# Altium project v1-RP5-Main_Board.PrjPcb (part 2 of 3)

## Sheet Display.SchDoc
size B; SheetNumber: 3; SheetTotal: 7
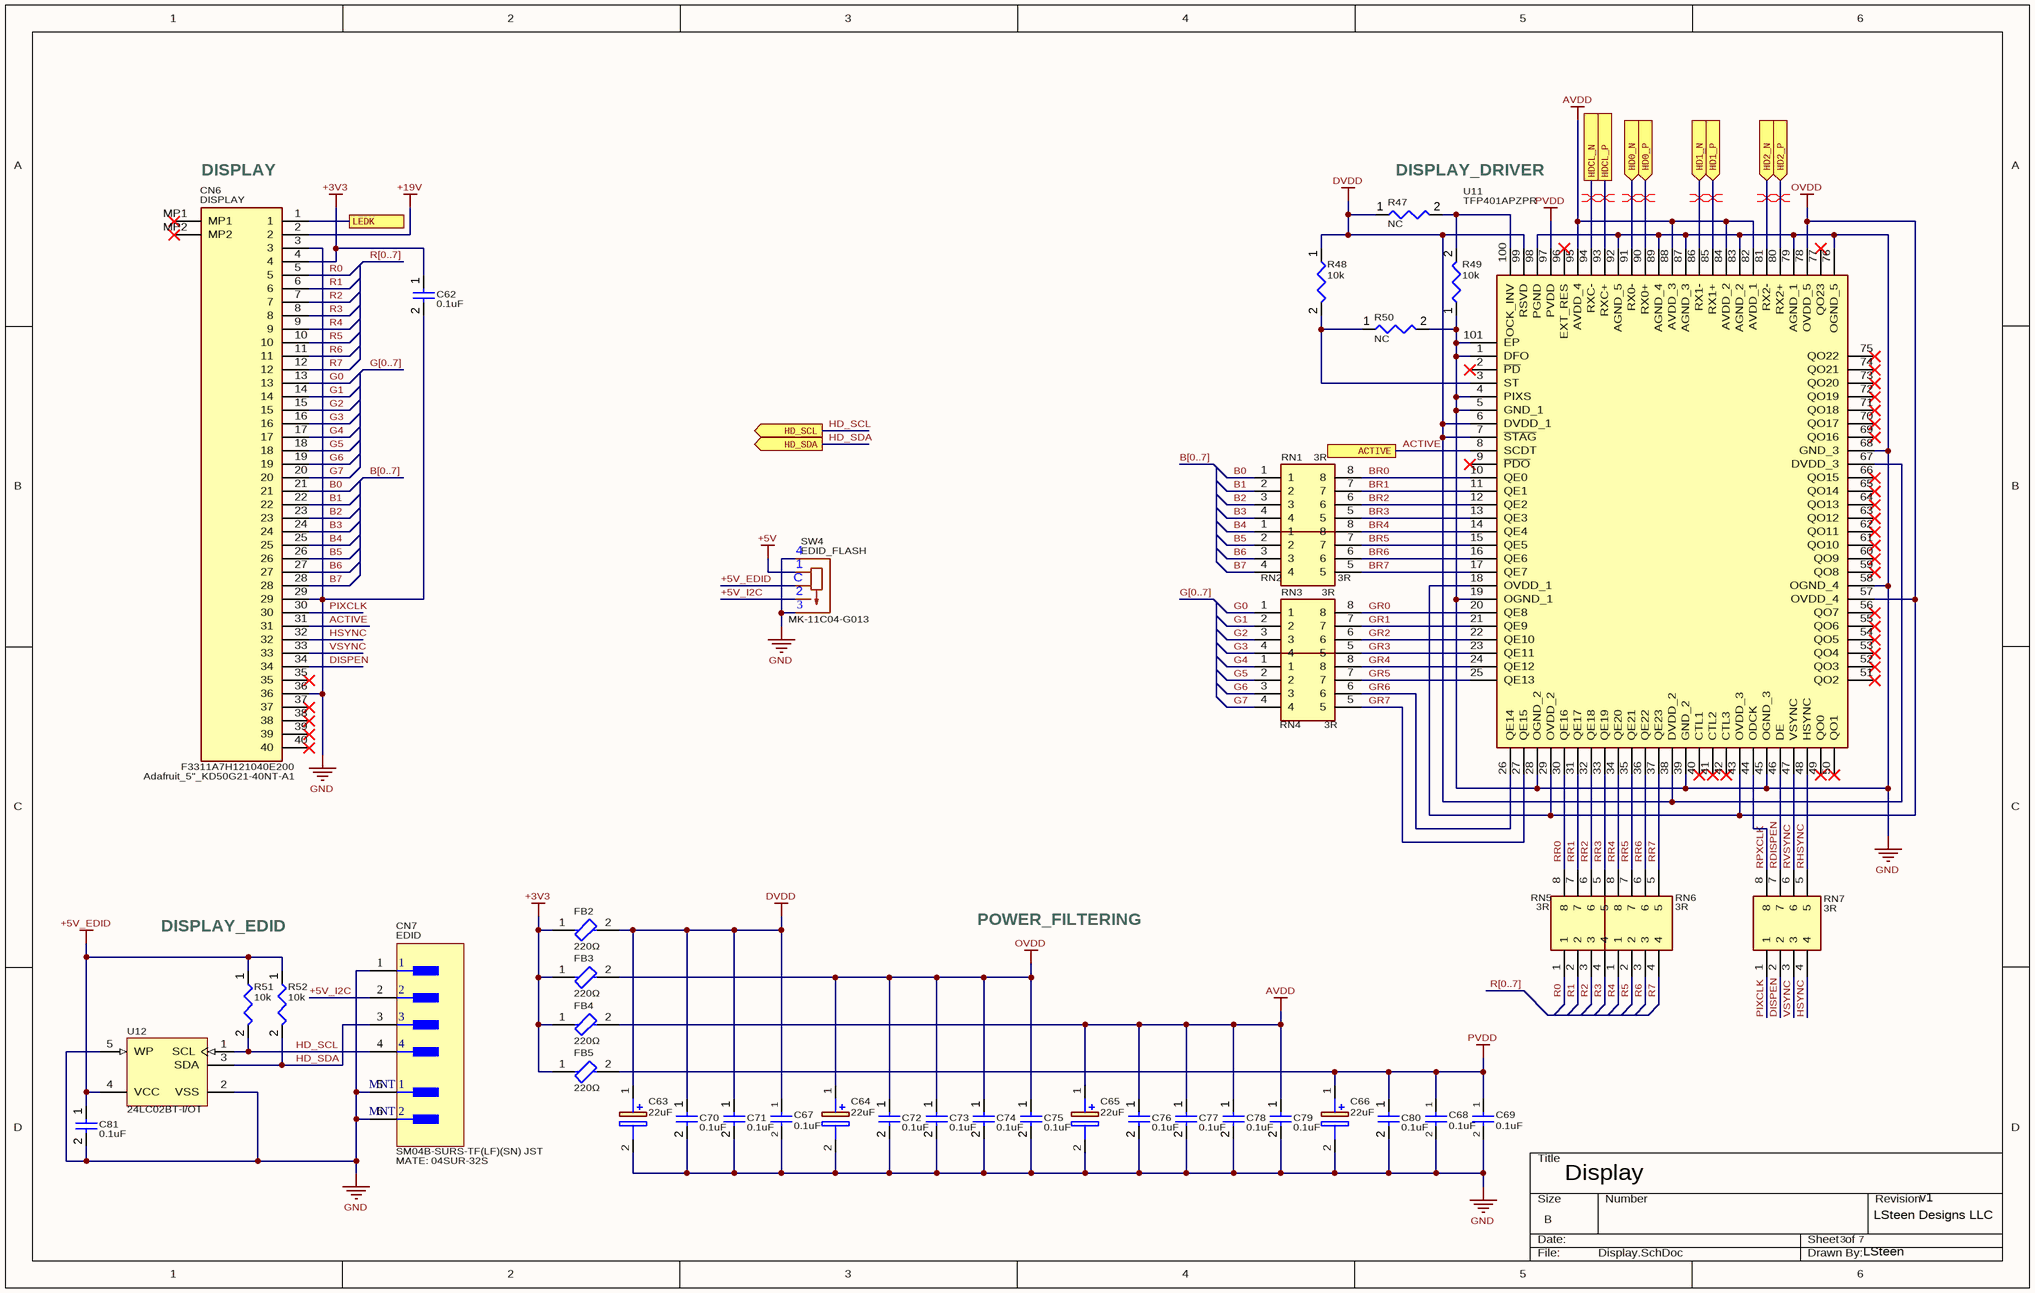
[diagram p2: Display.SchDoc]

### Parts
C62  0.1uF  [CAPC1005X56X25LL10T15]
C63  22uF  [CAPPC2114X150N]
C64  22uF  [CAPPC2114X150N]
C65  22uF  [CAPPC2114X150N]
C66  22uF  [CAPPC2114X150N]
C67  0.1uF  [CAPC1005X55N]
C68  0.1uF  [CAPC1005X55N]
C69  0.1uF  [CAPC1005X55N]
C70  0.1uF  [CAPC1005X56X25LL10T15]
C71  0.1uF  [CAPC1005X56X25LL10T15]
C72  0.1uF  [CAPC1005X56X25LL10T15]
C73  0.1uF  [CAPC1005X56X25LL10T15]
C74  0.1uF  [CAPC1005X56X25LL10T15]
C75  0.1uF  [CAPC1005X56X25LL10T15]
C76  0.1uF  [CAPC1005X56X25LL10T15]
C77  0.1uF  [CAPC1005X56X25LL10T15]
C78  0.1uF  [CAPC1005X56X25LL10T15]
C79  0.1uF  [CAPC1005X56X25LL10T15]
C80  0.1uF  [CAPC1005X56X25LL10T15]
C81  0.1uF  [CAPC1005X56X25LL10T15]
CN6  DISPLAY  [F3311A7H121040E200]
CN7  EDID  [FP-SM04B-SURS-TF_LF_SN-MFG]
FB2  220Ω  [FP-BLM18-0_15-t0_5-IPC_B]
FB3  220Ω  [FP-BLM18-0_15-t0_5-IPC_B]
FB4  220Ω  [FP-BLM18-0_15-t0_5-IPC_B]
FB5  220Ω  [FP-BLM18-0_15-t0_5-IPC_B]
R47  NC  [RESC0402(1005)_L]
R48  10k  [RESC0402(1005)_L]
R49  10k  [RESC0402(1005)_L]
R50  NC  [RESC0402(1005)_L]
R51  10k  [RESC0402(1005)_L]
R52  10k  [RESC0402(1005)_L]
RN1  3R  [YC124JR0733RL]
RN2  3R  [YC124JR0733RL]
RN3  3R  [YC124JR0733RL]
RN4  3R  [YC124JR0733RL]
RN5  3R  [YC124JR0733RL]
RN6  3R  [YC124JR0733RL]
RN7  3R  [YC124JR0733RL]
SW4  EDID_FLASH  [SW-SMD_MK-11C04-G013]
U11  TFP401APZPR  [QFP50P1600X1600X120-100N]
U12  24LC02BT-I/OT  [SOT-23-OT5_L]

### Ports
ACTIVE (see Power[5C]), HD0_N (in, see Module B High-Speed[4B]), HD0_P (in, see Module B High-Speed[4B]), HD1_N (in, see Module B High-Speed[4B]), HD1_P (in, see Module B High-Speed[4B]), HD2_N (in, see Module B High-Speed[4B]), HD2_P (in, see Module B High-Speed[4B]), HD_SCL (out, see Module B High-Speed[3B]), HD_SDA (out, see Module B High-Speed[3B]), HDCL_N (see Module B High-Speed[4B]), HDCL_P (see Module B High-Speed[4B]), LEDK (see Power[6B])

### Nets
+3V3: C62.1 CN6.4 FB2.1 FB3.1 FB4.1 FB5.1
+5V: SW4.1
+5V_EDID: C81.1 R51.1 R52.1 SW4.C U12.4(VCC)
+19V: CN6.2
AVDD: C65.1(+) C76.1 C77.1 C78.1 C79.1 FB4.2 U11.82(AVDD_1) U11.84(AVDD_2) U11.88(AVDD_3) U11.95(AVDD_4)
DVDD: C63.1(+) C67.1 C70.1 C71.1 FB2.2 R47.1 R48.1 U11.6(DVDD_1) U11.7(~{STAG}) U11.38(DVDD_2) U11.67(DVDD_3) U11.99(RSVD)
GND: C62.2 C63.2(-) C64.2(-) C65.2(-) C66.2(-) C67.2 C68.2 C69.2 C70.2 C71.2 C72.2 C73.2 C74.2 C75.2 C76.2 C77.2 C78.2 C79.2 C80.2 C81.2 CN6.3 CN6.29 CN6.36 CN7.1 CN7.5(MNT_1) CN7.6(MNT_2) R49.1 R50.2 SW4.3(NC) SW4.4 U11.1(DFO) U11.4(PIXS) U11.5(GND_1) U11.19(OGND_1) U11.28(OGND_2) U11.39(GND_2) U11.45(OGND_3) U11.58(OGND_4) U11.68(GND_3) U11.76(OGND_5) U11.79(AGND_1) U11.83(AGND_2) U11.87(AGND_3) U11.89(AGND_4) U11.92(AGND_5) U11.98(PGND) U11.101(EP) U12.2(VSS) U12.5(WP)
OVDD: C64.1(+) C72.1 C73.1 C74.1 C75.1 FB3.2 U11.18(OVDD_1) U11.29(OVDD_2) U11.43(OVDD_3) U11.57(OVDD_4) U11.78(OVDD_5)
PVDD: C66.1(+) C68.1 C69.1 C80.1 FB5.2 U11.97(PVDD)
+5V_I2C: CN7.2 SW4.2
ACTIVE: CN6.31 U11.8(SCDT) ; port ACTIVE
B0: CN6.21 RN1.1
B1: CN6.22 RN1.2
B2: CN6.23 RN1.3
B3: CN6.24 RN1.4
B4: CN6.25 RN2.1
B5: CN6.26 RN2.2
B6: CN6.27 RN2.3
B7: CN6.28 RN2.4
BR0: RN1.8 U11.10(QE0)
BR1: RN1.7 U11.11(QE1)
BR2: RN1.6 U11.12(QE2)
BR3: RN1.5 U11.13(QE3)
BR4: RN2.8 U11.14(QE4)
BR5: RN2.7 U11.15(QE5)
BR6: RN2.6 U11.16(QE6)
BR7: RN2.5 U11.17(QE7)
DISPEN: CN6.34 RN7.2
G0: CN6.13 RN3.1
G1: CN6.14 RN3.2
G2: CN6.15 RN3.3
G3: CN6.16 RN3.4
G4: CN6.17 RN4.1
G5: CN6.18 RN4.2
G6: CN6.19 RN4.3
G7: CN6.20 RN4.4
GR0: RN3.8 U11.20(QE8)
GR1: RN3.7 U11.21(QE9)
GR2: RN3.6 U11.22(QE10)
GR3: RN3.5 U11.23(QE11)
GR4: RN4.8 U11.24(QE12)
GR5: RN4.7 U11.25(QE13)
GR6: RN4.6 U11.26(QE14)
GR7: RN4.5 U11.27(QE15)
HD0_N: U11.91(RX0-) ; port HD0_N
HD0_P: U11.90(RX0+) ; port HD0_P
HD1_N: U11.86(RX1-) ; port HD1_N
HD1_P: U11.85(RX1+) ; port HD1_P
HD2_N: U11.81(RX2-) ; port HD2_N
HD2_P: U11.80(RX2+) ; port HD2_P
HD_SCL: CN7.4 R51.2 U12.1(SCL) ; port HD_SCL
HD_SDA: CN7.3 R52.2 U12.3(SDA) ; port HD_SDA
HDCL_N: U11.94(RXC-) ; port HDCL_N
HDCL_P: U11.93(RXC+) ; port HDCL_P
HSYNC: CN6.32 RN7.4
LEDK: CN6.1 ; port LEDK
PIXCLK: CN6.30 RN7.1
R0: CN6.5 RN5.1
R1: CN6.6 RN5.2
R2: CN6.7 RN5.3
R3: CN6.8 RN5.4
R4: CN6.9 RN6.1
R5: CN6.10 RN6.2
R6: CN6.11 RN6.3
R7: CN6.12 RN6.4
RDISPEN: RN7.7 U11.46(DE)
RHSYNC: RN7.5 U11.48(HSYNC)
RPXCLK: RN7.8 U11.44(ODCK)
RR0: RN5.8 U11.30(QE16)
RR1: RN5.7 U11.31(QE17)
RR2: RN5.6 U11.32(QE18)
RR3: RN5.5 U11.33(QE19)
RR4: RN6.8 U11.34(QE20)
RR5: RN6.7 U11.35(QE21)
RR6: RN6.6 U11.36(QE22)
RR7: RN6.5 U11.37(QE23)
RVSYNC: RN7.6 U11.47(VSYNC)
VSYNC: CN6.33 RN7.3
NetR47_2: R47.2 R49.2 U11.100(OCK_INV)
NetR48_2: R48.2 R50.1 U11.3(ST)

Not connected (* = marked no-connect by the designer): CN6 35* 37* 38* 39* 40* MP1* MP2*; U11 2(~{PD})* 9(~{PDO})* 40(CTL1)* 41(CTL2)* 42(CTL3)* 49(QO0)* 50(QO1)* 51(QO2)* 52(QO3)* 53(QO4)* 54(QO5)* 55(QO6)* 56(QO7)* 59(QO8)* 60(QO9)* 61(QO10)* 62(QO11)* 63(QO12)* 64(QO13)* 65(QO14)* 66(QO15)* 69(QO16)* 70(QO17)* 71(QO18)* 72(QO19)* 73(QO20)* 74(QO21)* 75(QO22)* 77(QO23)* 96(EXT_RES)*

### Buses and harness runs
bus B[0..7]
bus G[0..7]
bus R[0..7]

### Layout directives
differential pair; differential pair class HDMI: HD0_N, HD0_P, HD1_N, HD1_P, HD2_N, HD2_P, HDCL_N, HDCL_P

### Notes on the sheet
- (near CN6) DISPLAY
- (near R47) DISPLAY_DRIVER
- (near SW4) MK-11C04-G013
- (near CN6) F3311A7H121040E200
- (near CN6) Adafruit_5"_KD50G21-40NT-A1
- DISPLAY_EDID
- POWER_FILTERING
- (near CN7) MATE: 04SUR-32S
- (near CN7) SM04B-SURS-TF(LF)(SN) JST
- Display
- 3
- 7
- LSteen Designs LLC
- v1
- LSteen

### Library data of the parts
C62 C70-C81 = CMP-001-00001-6: as C14 on sheet Power; Max Operating Temperature: 125°C; Min Operating Temperature: -55°C; Case/Package: 0402; Value: 0.1uF; Mounting Technology: SM; Pins: 2; Tolerance: 5%; RoHS Compliant: True
C63-C66 = TACR226K006XTA: Capacitor Polarised; Manufacturer_Name: Kyocera AVX; Datasheet Link: https://datasheet.datasheetarchive.com/originals/dk/DKDS-7/134542.pdf; Height: 1.5mm; Manufacturer_Part_Number: TACR226K006XTA; Mouser Part Number: 581-TACR226K006X; Mouser Price/Stock: https://www.mouser.co.uk/ProductDetail/AVX/TACR226K006XTA?qs=1dejQ3qkUTm9Nv2ucYYT5g%3D%3D; Arrow Part Number: TACR226K006XTA; Arrow Price/Stock: https://www.arrow.com/en/products/tacr226k006xta/avx
C67-C69 = C0402: Height: 0.55mm
CN6 = F3311A7H121040E200: Connector; Manufacturer_Name: Amphenol Communications Solutions; Datasheet Link: https://cdn.amphenol-cs.com/media/wysiwyg/files/documentation/datasheet/flex/ffc_fpc_050mm_f331.pdf; Height: 1.22mm; Manufacturer_Part_Number: F3311A7H121040E200; Supplier 1: Mouser; Supplier Part Number 1: 649-311A7H121040E200
CN7 = CMP-17439-000307-2: CONN HEADER SMD R/A 4POS 0.8MM; NexarPartId: 2647826; Gender: Male; Working Voltage: 30V; Number of Poles: 4; Body Plating: Tin; Wire/Cable Gauge: 32AWG; Current Rating: 500mA; Termination: IDC; Material: Polyamide; Contact Plating: Tin; REACH SVHC: No SVHC; Max Operating Temperature: 85°C; Min Operating Temperature: -25°C; Flammability Rating: UL94 V-0; Number of Rows: 1; Contact Material: Tin; Number of Contacts: 4; Case/Package: SMD/SMT; Voltage Rating: 30V; Lead Pitch: 800µm; Lead Free: Lead Free; Height: 1.75mm; RoHS: Compliant; Voltage Rating (DC): 30V
FB2-FB5 = CMP-06046-002311-1: as FB1 on sheet Power; RoHS Compliant: Yes
R47 R50 = CMP-009-00138-3: Chip Resistor, 0 Ohms, +/-5 %, 63 mW, -55 to 155 degC, 0402; Value: 0R; Tolerance: 5%; Power: 63mW; Max Operating Temperature: 155°C; Pins: 2; Min Operating Temperature: -55°C; Case/Package: 0402
R48 R49 R51 R52 = CMP-009-00138-3: Chip Resistor, 10 kOhms, +/-5 %, 63 mW, -55 to 155 degC, 0402; Tolerance: 5%; Power: 63mW; Max Operating Temperature: 155°C; Pins: 2; Value: 10k; Min Operating Temperature: -55°C; Case/Package: 0402
RN1-RN7 = YC124-JR-073RL: Resistor Network; Manufacturer_Name: YAGEO; Manufacturer_Part_Number: YC124-JR-0733RL; Datasheet Link: https://www.yageo.com/upload/media/product/productsearch/datasheet/rchip/PYu-YC_TC_group_51_RoHS_L_9.pdf; Height: 0.55mm; Mouser Part Number: 603-YC124-JR-0733RL; Mouser Price/Stock: https://www.mouser.co.uk/ProductDetail/YAGEO/YC124-JR-0733RL?qs=o9qB%2F%252BVTi4U0zU6ismVxOQ%3D%3D; Arrow Part Number: YC124-JR-0733RL; Arrow Price/Stock: https://www.arrow.com/en/products/yc124-jr-0733rl/yageo?region=nac
SW4 = MK-11C04-G013: SPDT 1A 6V Slide Switch; Supplier 1: LCSC; Supplier Part Number 1: C778185
U11 = TFP401APZPR: Integrated Circuit; Manufacturer_Name: Texas Instruments; Datasheet Link: http://www.ti.com/lit/gpn/TFP401A; Height: 1.2mm; Manufacturer_Part_Number: TFP401APZPR; Mouser Part Number: 595-TFP401APZPR; Mouser Price/Stock: https://www.mouser.co.uk/ProductDetail/Texas-Instruments/TFP401APZPR?qs=lc2O%252BfHJPVYfuIDQbAsRYg%3D%3D; Arrow Part Number: TFP401APZPR; Arrow Price/Stock: https://www.arrow.com/en/products/tfp401apzpr/texas-instruments?region=nac; Supplier 1: Mouser; Supplier Part Number 1: 595-TFP401APZPR
U12 = CMP-0159-00645-1: 2Kbit, 400kHz, 2.5V, I2C Serial EEPROM, 5-Pin SOT-23, Industrial Temperature, Tape and Reel; PackageVersion: revBB, Aug-2009; DatasheetVersion: revJ, Feb-2009; PackageDescription: 5-Lead Plastic Small Outline Transistor (OT) [SOT-23]; PackageReference: SOT-23-OT5; Code_IPC: SOT23-5

## Sheet Module A IO.SchDoc
size A2; SheetNumber: 4; SheetTotal: 7
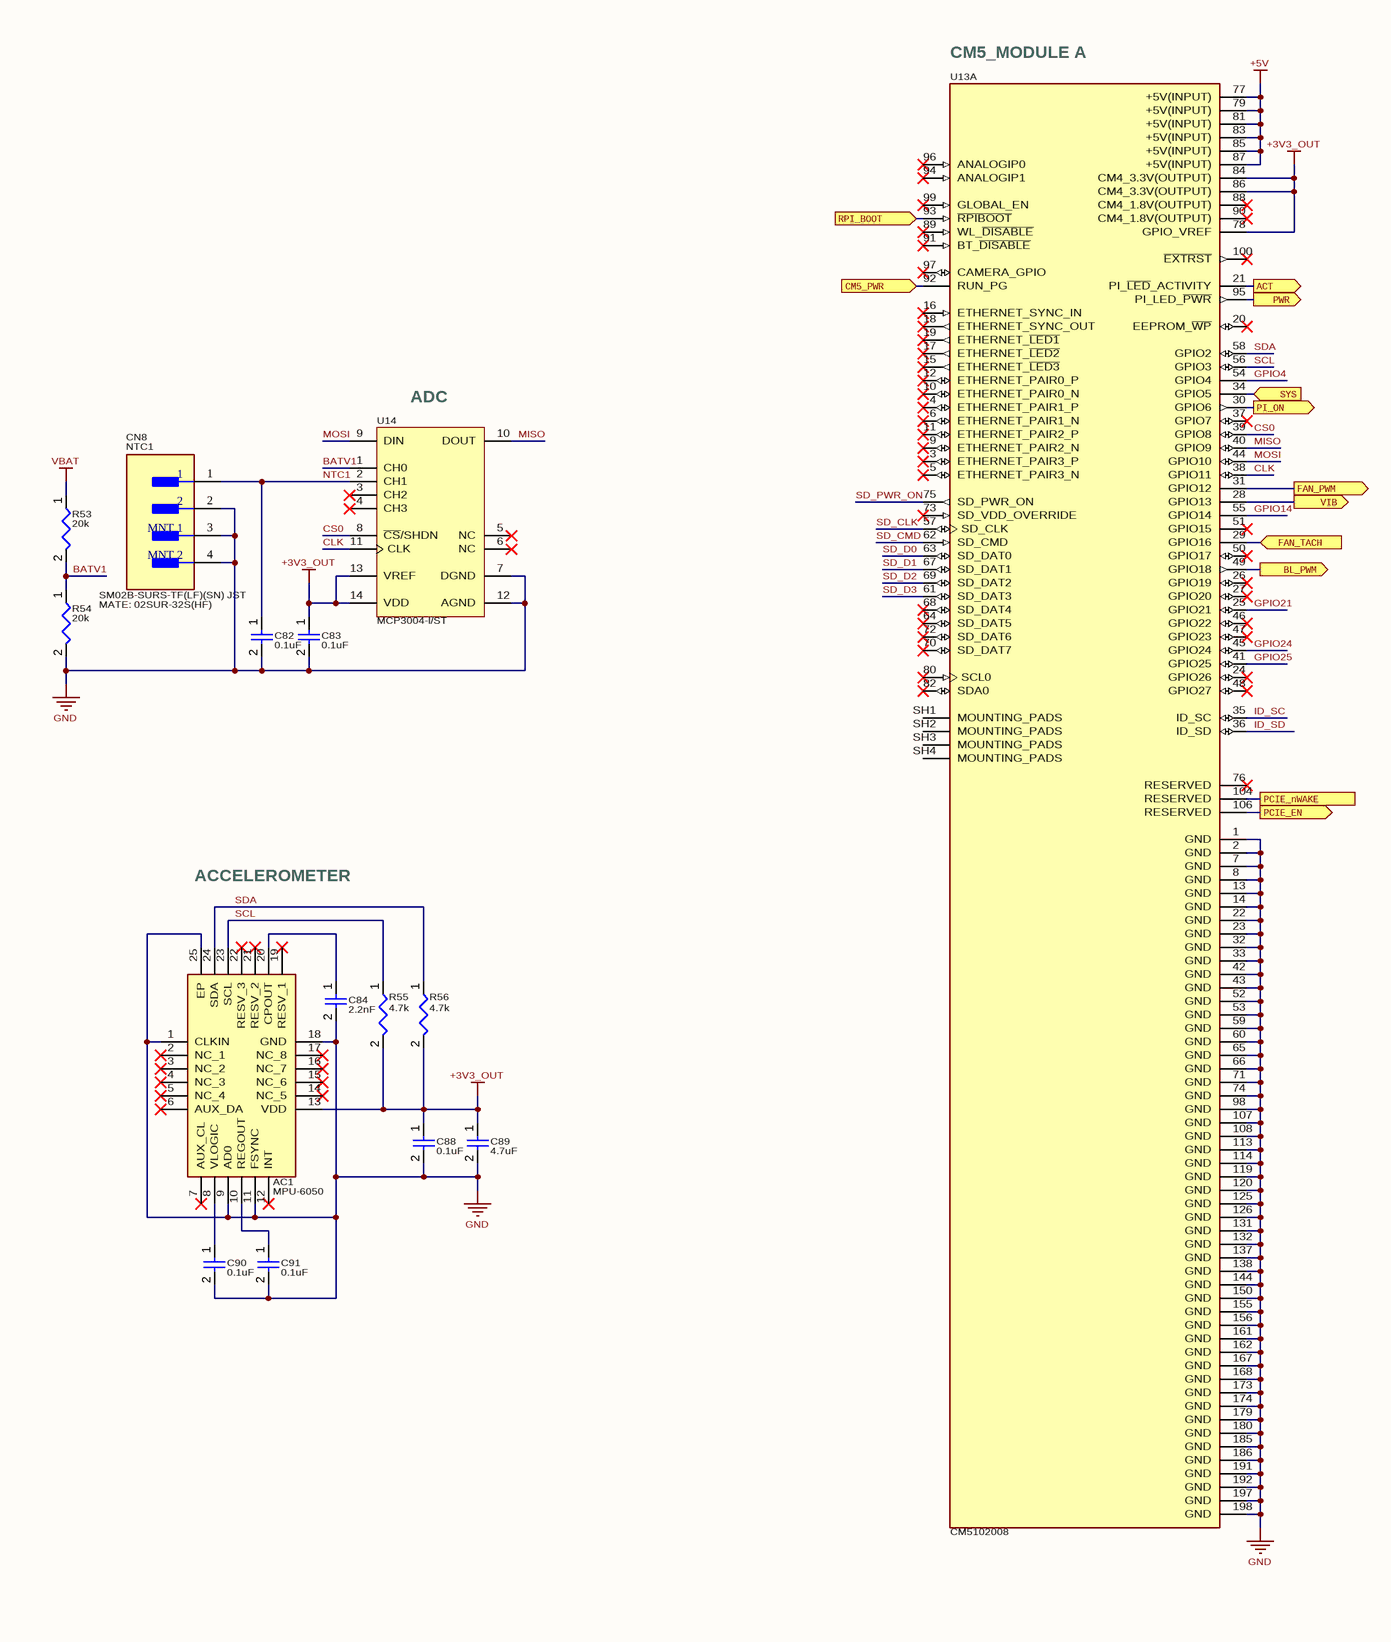
[diagram p3: Module A IO.SchDoc, left]
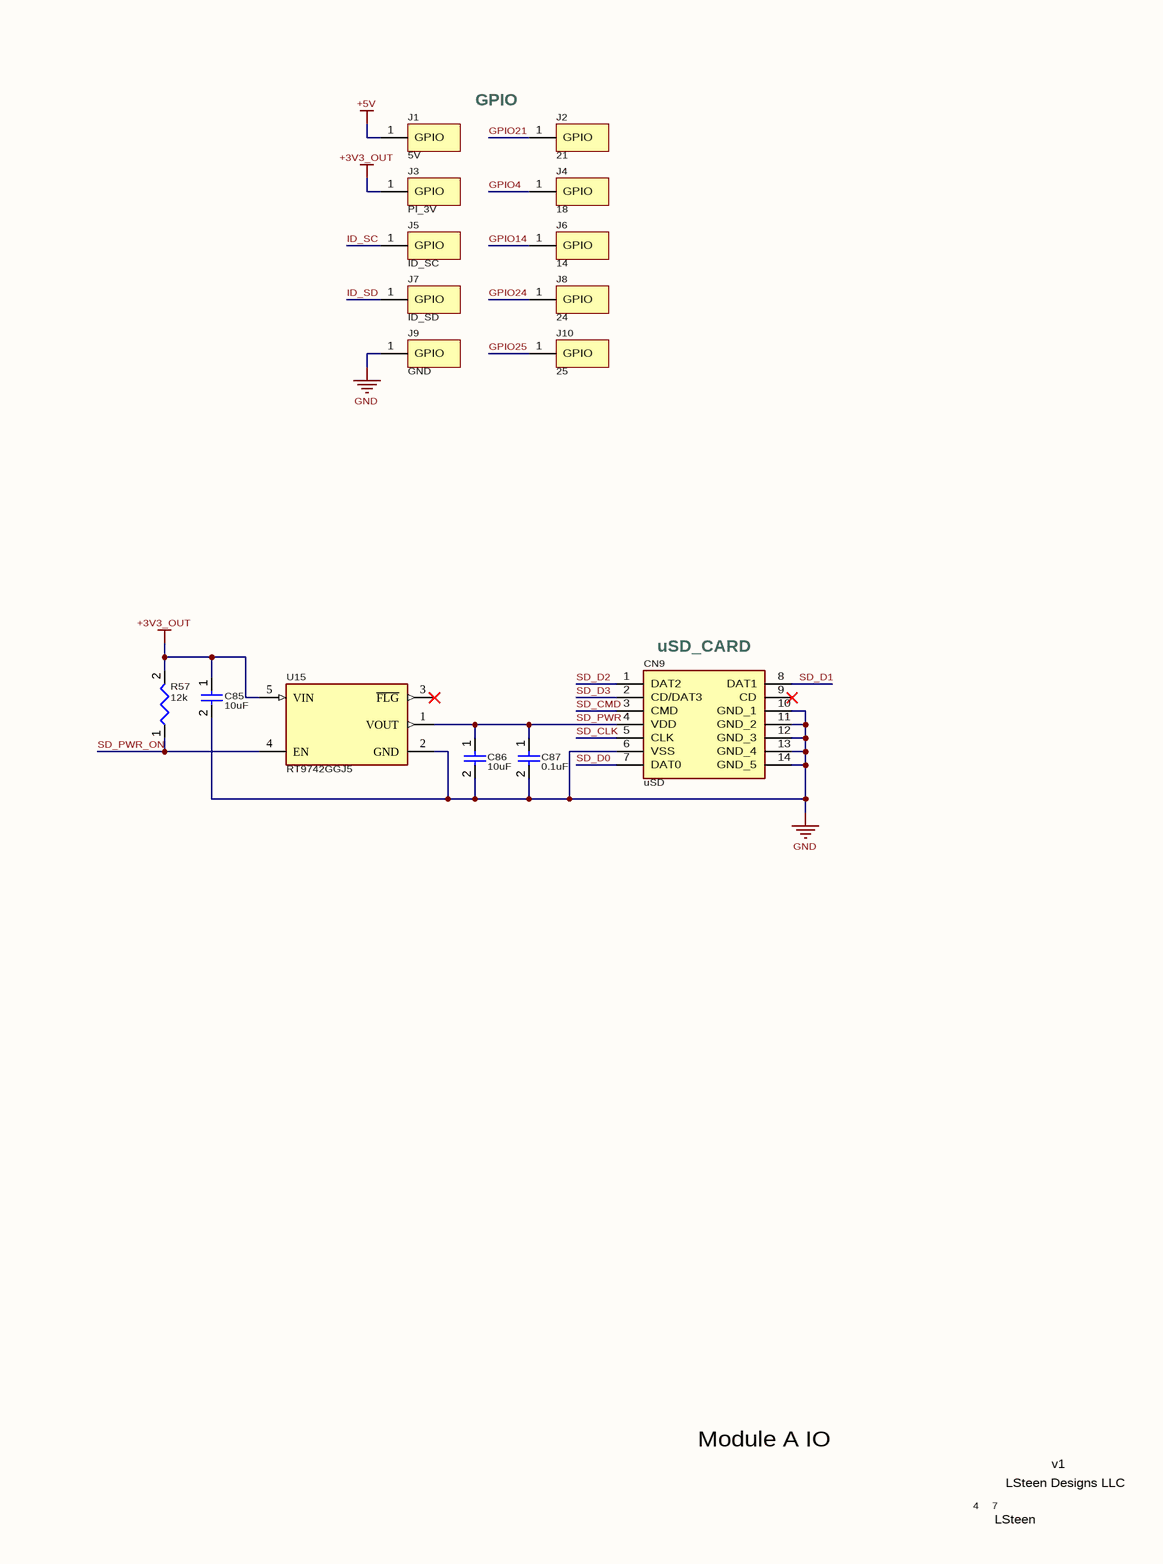
[diagram p4: Module A IO.SchDoc, right]

### Parts
AC1  MPU-6050  [MPU6050]
C82  0.1uF  [CAPC1005X56X25LL10T15]
C83  0.1uF  [CAPC1005X56X25LL10T15]
C84  2.2nF  [CAPC1005X56X25LL10T15]
C85  10uF  [CAPC0603(1608)100_L]
C86  10uF  [CAPC0603(1608)100_L]
C87  0.1uF  [CAPC1005X56X25LL10T15]
C88  0.1uF  [CAPC1005X56X25LL10T15]
C89  4.7uF  [CAPC0603(1608)100_L]
C90  0.1uF  [CAPC1005X56X25LL10T15]
C91  0.1uF  [CAPC1005X56X25LL10T15]
CN8  NTC1  [FP-SM02B-SURS-TF_LF_SN-MFG]
CN9  uSD  [MSD9A]
J1  5V  [GPIO]
J2  21  [GPIO]
J3  PI_3V  [GPIO]
J4  18  [GPIO]
J5  ID_SC  [GPIO]
J6  14  [GPIO]
J7  ID_SD  [GPIO]
J8  24  [GPIO]
J9  GND  [GPIO]
J10  25  [GPIO]
R53  20k  [RESC0402(1005)_L]
R54  20k  [RESC0402(1005)_L]
R55  4.7k  [RESC0402(1005)_L]
R56  4.7k  [RESC0402(1005)_L]
R57  12k  [RESC0402(1005)_L]
U13  CM5102008  [MODULE_CM4102008]  (part A of 2)
U14  MCP3004-I/ST  [TSSOP-ST14_M]
U15  RT9742GGJ5  [FP-RT9742GGJ5-IPC_C]

### Ports
ACT (out, see USB[5B]), BL_PWM (out, see Power[5B]), CM5_PWR (in, see Power[5D]), FAN_PWM (out, see Power[4C]), FAN_TACH (in, see Power[4C]), PCIE_EN (out, see USB[6B]), PCIE_nWAKE (see USB[7B]), PI_ON (out, see Power[6D]), PWR (out, see USB[5B]), RPI_BOOT (in, see USB[6D]), SYS (in, see USB[5B]), VIB (out, see USB[7B])

### Nets
+3V3_OUT: AC1.13(VDD) C83.1 C85.1 C88.1 C89.1 J3.1(GPIO) R55.2 R56.2 R57.2 U13.78(GPIO_VREF) U13.84(CM4_3.3V(OUTPUT)) U13.86(CM4_3.3V(OUTPUT)) U14.13(VREF) U14.14(VDD) U15.5(VIN)
+5V: J1.1(GPIO) U13.77(+5V(INPUT)) U13.79(+5V(INPUT)) U13.81(+5V(INPUT)) U13.83(+5V(INPUT)) U13.85(+5V(INPUT)) U13.87(+5V(INPUT))
GND: AC1.1(CLKIN) AC1.9(AD0) AC1.11(FSYNC) AC1.18(GND) AC1.25(EP) C82.2 C83.2 C84.2 C85.2 C86.2 C87.2 C88.2 C89.2 C90.2 C91.2 CN8.2 CN8.3(MNT_1) CN8.4(MNT_2) CN9.6(VSS) CN9.10(GND_1) CN9.11(GND_2) CN9.12(GND_3) CN9.13(GND_4) CN9.14(GND_5) J9.1(GPIO) R54.2 U13.1(GND) U13.2(GND) U13.7(GND) U13.8(GND) U13.13(GND) U13.14(GND) U13.22(GND) U13.23(GND) U13.32(GND) U13.33(GND) U13.42(GND) U13.43(GND) U13.52(GND) U13.53(GND) U13.59(GND) U13.60(GND) U13.65(GND) U13.66(GND) U13.71(GND) U13.74(GND) U13.98(GND) U13.107(GND) U13.108(GND) U13.113(GND) U13.114(GND) U13.119(GND) U13.120(GND) U13.125(GND) U13.126(GND) U13.131(GND) U13.132(GND) U13.137(GND) U13.138(GND) U13.144(GND) U13.150(GND) U13.155(GND) U13.156(GND) U13.161(GND) U13.162(GND) U13.167(GND) U13.168(GND) U13.173(GND) U13.174(GND) U13.179(GND) U13.180(GND) U13.185(GND) U13.186(GND) U13.191(GND) U13.192(GND) U13.197(GND) U13.198(GND) U14.7(DGND) U14.12(AGND) U15.2(GND)
VBAT: R53.1
ACT: U13.21(PI_~{LED}_ACTIVITY) ; port ACT
BATV1: R53.2 R54.1 U14.1(CH0)
BL_PWM: U13.49(GPIO18) ; port BL_PWM
CLK: U13.38(GPIO11) U14.11(CLK)
CM5_PWR: U13.92(RUN_PG) ; port CM5_PWR
CS0: U13.39(GPIO8) U14.8(~{CS}/SHDN)
FAN_PWM: U13.31(GPIO12) ; port FAN_PWM
FAN_TACH: U13.29(GPIO16) ; port FAN_TACH
GPIO4: J4.1(GPIO) U13.54(GPIO4)
GPIO14: J6.1(GPIO) U13.55(GPIO14)
GPIO21: J2.1(GPIO) U13.25(GPIO21)
GPIO24: J8.1(GPIO) U13.45(GPIO24)
GPIO25: J10.1(GPIO) U13.41(GPIO25)
ID_SC: J5.1(GPIO) U13.35(ID_SC)
ID_SD: J7.1(GPIO) U13.36(ID_SD)
MISO: U13.40(GPIO9) U14.10(DOUT)
MOSI: U13.44(GPIO10) U14.9(DIN)
NTC1: C82.1 CN8.1 U14.2(CH1)
PCIE_EN: U13.106(RESERVED) ; port PCIE_EN
PCIE_nWAKE: U13.104(RESERVED) ; port PCIE_nWAKE
PI_ON: U13.30(GPIO6) ; port PI_ON
PWR: U13.95(PI_LED_~{PWR}) ; port PWR
RPI_BOOT: U13.93(~{RPIBOOT}) ; port RPI_BOOT
SCL: AC1.23(SCL) R55.1 U13.56(GPIO3)
SD_CLK: CN9.5(CLK) U13.57(SD_CLK)
SD_CMD: CN9.3(CMD) U13.62(SD_CMD)
SD_D0: CN9.7(DAT0) U13.63(SD_DAT0)
SD_D1: CN9.8(DAT1) U13.67(SD_DAT1)
SD_D2: CN9.1(DAT2) U13.69(SD_DAT2)
SD_D3: CN9.2(CD/DAT3) U13.61(SD_DAT3)
SD_PWR: C86.1 C87.1 CN9.4(VDD) U15.1(VOUT)
SD_PWR_ON: R57.1 U13.75(SD_PWR_ON) U15.4(EN)
SDA: AC1.24(SDA) R56.1 U13.58(GPIO2)
SYS: U13.34(GPIO5) ; port SYS
VIB: U13.28(GPIO13) ; port VIB
NetAC1_8: AC1.8(VLOGIC) C90.1
NetAC1_10: AC1.10(REGOUT) C91.1
NetAC1_20: AC1.20(CPOUT) C84.1

Not connected (* = marked no-connect by the designer): AC1 2(NC_1)* 3(NC_2)* 4(NC_3)* 5(NC_4)* 6(AUX_DA)* 7(AUX_CL)* 12(INT)* 14(NC_5)* 15(NC_6)* 16(NC_7)* 17(NC_8)* 19(RESV_1)* 21(RESV_2)* 22(RESV_3)*; CN9 9(CD)*; U13 3(ETHERNET_PAIR3_P)* 4(ETHERNET_PAIR1_P)* 5(ETHERNET_PAIR3_N)* 6(ETHERNET_PAIR1_N)* 9(ETHERNET_PAIR2_N)* 10(ETHERNET_PAIR0_N)* 11(ETHERNET_PAIR2_P)* 12(ETHERNET_PAIR0_P)* 15(ETHERNET_~{LED3})* 16(ETHERNET_SYNC_IN)* 17(ETHERNET_~{LED2})* 18(ETHERNET_SYNC_OUT)* 19(ETHERNET_~{LED1})* 20(EEPROM_~{WP})* 24(GPIO26)* 26(GPIO19)* 27(GPIO20)* 37(GPIO7)* 46(GPIO22)* 47(GPIO23)* 48(GPIO27)* 50(GPIO17)* 51(GPIO15)* 64(SD_DAT5)* 68(SD_DAT4)* 70(SD_DAT7)* 72(SD_DAT6)* 73(SD_VDD_OVERRIDE)* 76(RESERVED)* 80(SCL0)* 82(SDA0)* 88(CM4_1.8V(OUTPUT))* 89(WL_~{DISABLE})* 90(CM4_1.8V(OUTPUT))* 91(BT_~{DISABLE})* 94(ANALOGIP1)* 96(ANALOGIP0)* 97(CAMERA_GPIO)* 99(GLOBAL_EN)* 100(~{EXTRST})* SH1(MOUNTING_PADS) SH2(MOUNTING_PADS) SH3(MOUNTING_PADS) SH4(MOUNTING_PADS); U14 3(CH2)* 4(CH3)* 5(NC)* 6(NC)*; U15 3(~{FLG})*

### Notes on the sheet
- (near U13) CM5_MODULE A
- (near U14) ADC
- GPIO
- MATE: 02SUR-32S(HF)
- SM02B-SURS-TF(LF)(SN) JST
- ACCELEROMETER
- (near CN9) uSD_CARD
- Module A IO
- 4
- 7
- LSteen
- LSteen Designs LLC
- v1

### Library data of the parts
AC1 = MPU-6050: Integrated Circuit; Manufacturer_Name: TDK; Datasheet Link: https://product.tdk.com/system/files/dam/doc/product/sensor/mortion-inertial/imu/data_sheet/mpu-6000-datasheet1.pdf; Height: 0.95mm; Manufacturer_Part_Number: MPU-6050; Mouser Part Number: 410-MPU-6050; Mouser Price/Stock: https://www.mouser.co.uk/ProductDetail/TDK-InvenSense/MPU-6050?qs=u4fy%2FsgLU9O14B5JgyQFvg%3D%3D; Arrow Part Number: MPU-6050; Arrow Price/Stock: https://www.arrow.com/en/products/mpu-6050/invensense?region=nac; Supplier 1: LCSC; Supplier Part Number 1: C24112
C82 C83 C87 C88 C90 C91 = CMP-001-00001-6: as C14 on sheet Power; Max Operating Temperature: 125°C; Min Operating Temperature: -55°C; Case/Package: 0402; Value: 0.1uF; Mounting Technology: SM; Pins: 2; Tolerance: 5%; RoHS Compliant: True
C84 = CMP-001-00001-6: Chip Capacitor, 2.2nF, +/- 5%, 16 V, 0402 (1005 Metric); Capacitor Type: Ceramic; Voltage Rating: 16V; Max Operating Temperature: 125°C; Min Operating Temperature: -55°C; Case/Package: 0402; Value: 2.2nF; Mounting Technology: SM; Pins: 2; Tolerance: 5%; RoHS Compliant: True
C85 C86 = CMP-001-00076-4: as C13 on sheet Power; Mounting Technology: SMT; Case/Package: 0603; Pins: 2; Min Operating Temperature: -55°C; Max Operating Temperature: 85°C; Value: 10uF; Voltage Rating: 10V
C89 = CMP-001-00076-4: Chip Capacitor, 4.7uF +/-20%, 10V, 0603, Thickness 1 mm; Tolerance: 10%; Mounting Technology: SMT; Case/Package: 0603; Pins: 2; Min Operating Temperature: -55°C; Max Operating Temperature: 85°C; Value: 4.7uF; Voltage Rating: 10V
CN8 = CMP-17439-000279-1: as CN3 on sheet Power; Lead Pitch: 0.8mm; Color: Natural; Min Operating Temperature: -25°C; Insulation Material: Nylon; Number of Rows: 1; Flammability Rating: UL94 V-0; Number of Positions: 2; Contact Shape: Rectangular; Orientation: Horizontal; Contact Material: Copper Alloy; Fastening Type: Pull; Max Operating Temperature: 85°C; Termination: Solder; Contact Type: Outer Shroud Contact; Series: SUR; Insulation Color: Natural; Packaging: Cut Tape; Contact Finish - Mating: TIN; REACH SVHC: No SVHC; Pitch: 0.8mm; Contact Plating: Tin; Lead Free: Lead Free; Voltage Rating: 30V; Mount: Surface Mount; Connector Type: Header; Number of Poles: 2; Material: Polyamide
CN9 = MSD-9-A: Connector; Manufacturer_Name: CUI Devices; Datasheet Link: https://www.cuidevices.com/product/resource/msd-9-a.pdf; Height: 1.65mm; Manufacturer_Part_Number: MSD-9-A; Supplier 1: Mouser; Supplier Part Number 1: 179-MSD-9-A
J1-J10 = GPIO: AUX_I/O
R53 R54 = CMP-009-00138-3: Chip Resistor, 20 kOhms, +/-5 %, 63 mW, -55 to 155 degC, 0402; Value: 40k; Tolerance: 5%; Power: 63mW; Max Operating Temperature: 155°C; Pins: 2; Min Operating Temperature: -55°C; Case/Package: 0402
R55 R56 = CMP-009-00138-3: Chip Resistor, 4.7 kOhms, +/-5 %, 63 mW, -55 to 155 degC, 0402; Tolerance: 5%; Power: 63mW; Max Operating Temperature: 155°C; Pins: 2; Value: 4.7k; Min Operating Temperature: -55°C; Case/Package: 0402
R57 = CMP-009-00138-3: Chip Resistor, 12 kOhms, +/-5 %, 63 mW, -55 to 155 degC, 0402; Tolerance: 5%; Power: 63mW; Max Operating Temperature: 155°C; Pins: 2; Value: 12k; Min Operating Temperature: -55°C; Case/Package: 0402
U13 = CM4102008: Raspberry Pi Compute Module 4 with WiFi 2GB RAM 8GB Flash | Raspberry Pi CM4102008; SnapEDA_Link: https://www.snapeda.com/parts/CM4102008/Raspberry+Pi/view-part/?ref=snap; Package: None; Value: *; MF: Raspberry Pi; MP: CM4102008; Check_prices: https://www.snapeda.com/parts/CM4102008/Raspberry+Pi/view-part/?ref=eda
U14 = CMP-0188-00879-2: 2.7V 4-Channel/8-Channel 10-Bit A/D Converters with SPI Serial Interface, 14-Pin TSSOP, Industrial Temperature; ComponentLink1URL: http://www.microchip.com/; RevisionNote: URLs added.; PackageDescription: 14-Lead Plastic Thin Shrink Small Outline (ST) - 4.4mm Body [TSSOP]; ComponentLink3Description: Package Specification; ComponentLink2Description: Datasheet; ComponentLink3URL: http://www.microchip.com/stellent/groups/techpub_sg/documents/packagingspec/en012702.pdf; PackageReference: TSSOP-ST14; PackageVersion: revBB, Aug-2009; ComponentLink1Description: Manufacturer URL; ComponentLink2URL: http://ww1.microchip.com/downloads/en/DeviceDoc/21295d.pdf; DatasheetVersion: revD, Dec-2008
U15 = CMP-79883-000001-1: IC PWR SWTCH N-CHAN 1:1 TSOT23-5; Interface: On/Off; Fault Protection: Over Temperature; Max Output Current: 1A; Number of Outputs: 1; Output Configuration: High Side; On-State Resistance: 70mR; REACH SVHC: No SVHC; Number of Pins: 23; Packaging: Tape and Reel; Case/Package: SOT-23-5; RoHS Compliant: Yes; Max Operating Temperature: 85°C; Min Operating Temperature: -40°C

## Sheet Module B High-Speed.SchDoc
size A3; SheetNumber: 5; SheetTotal: 7
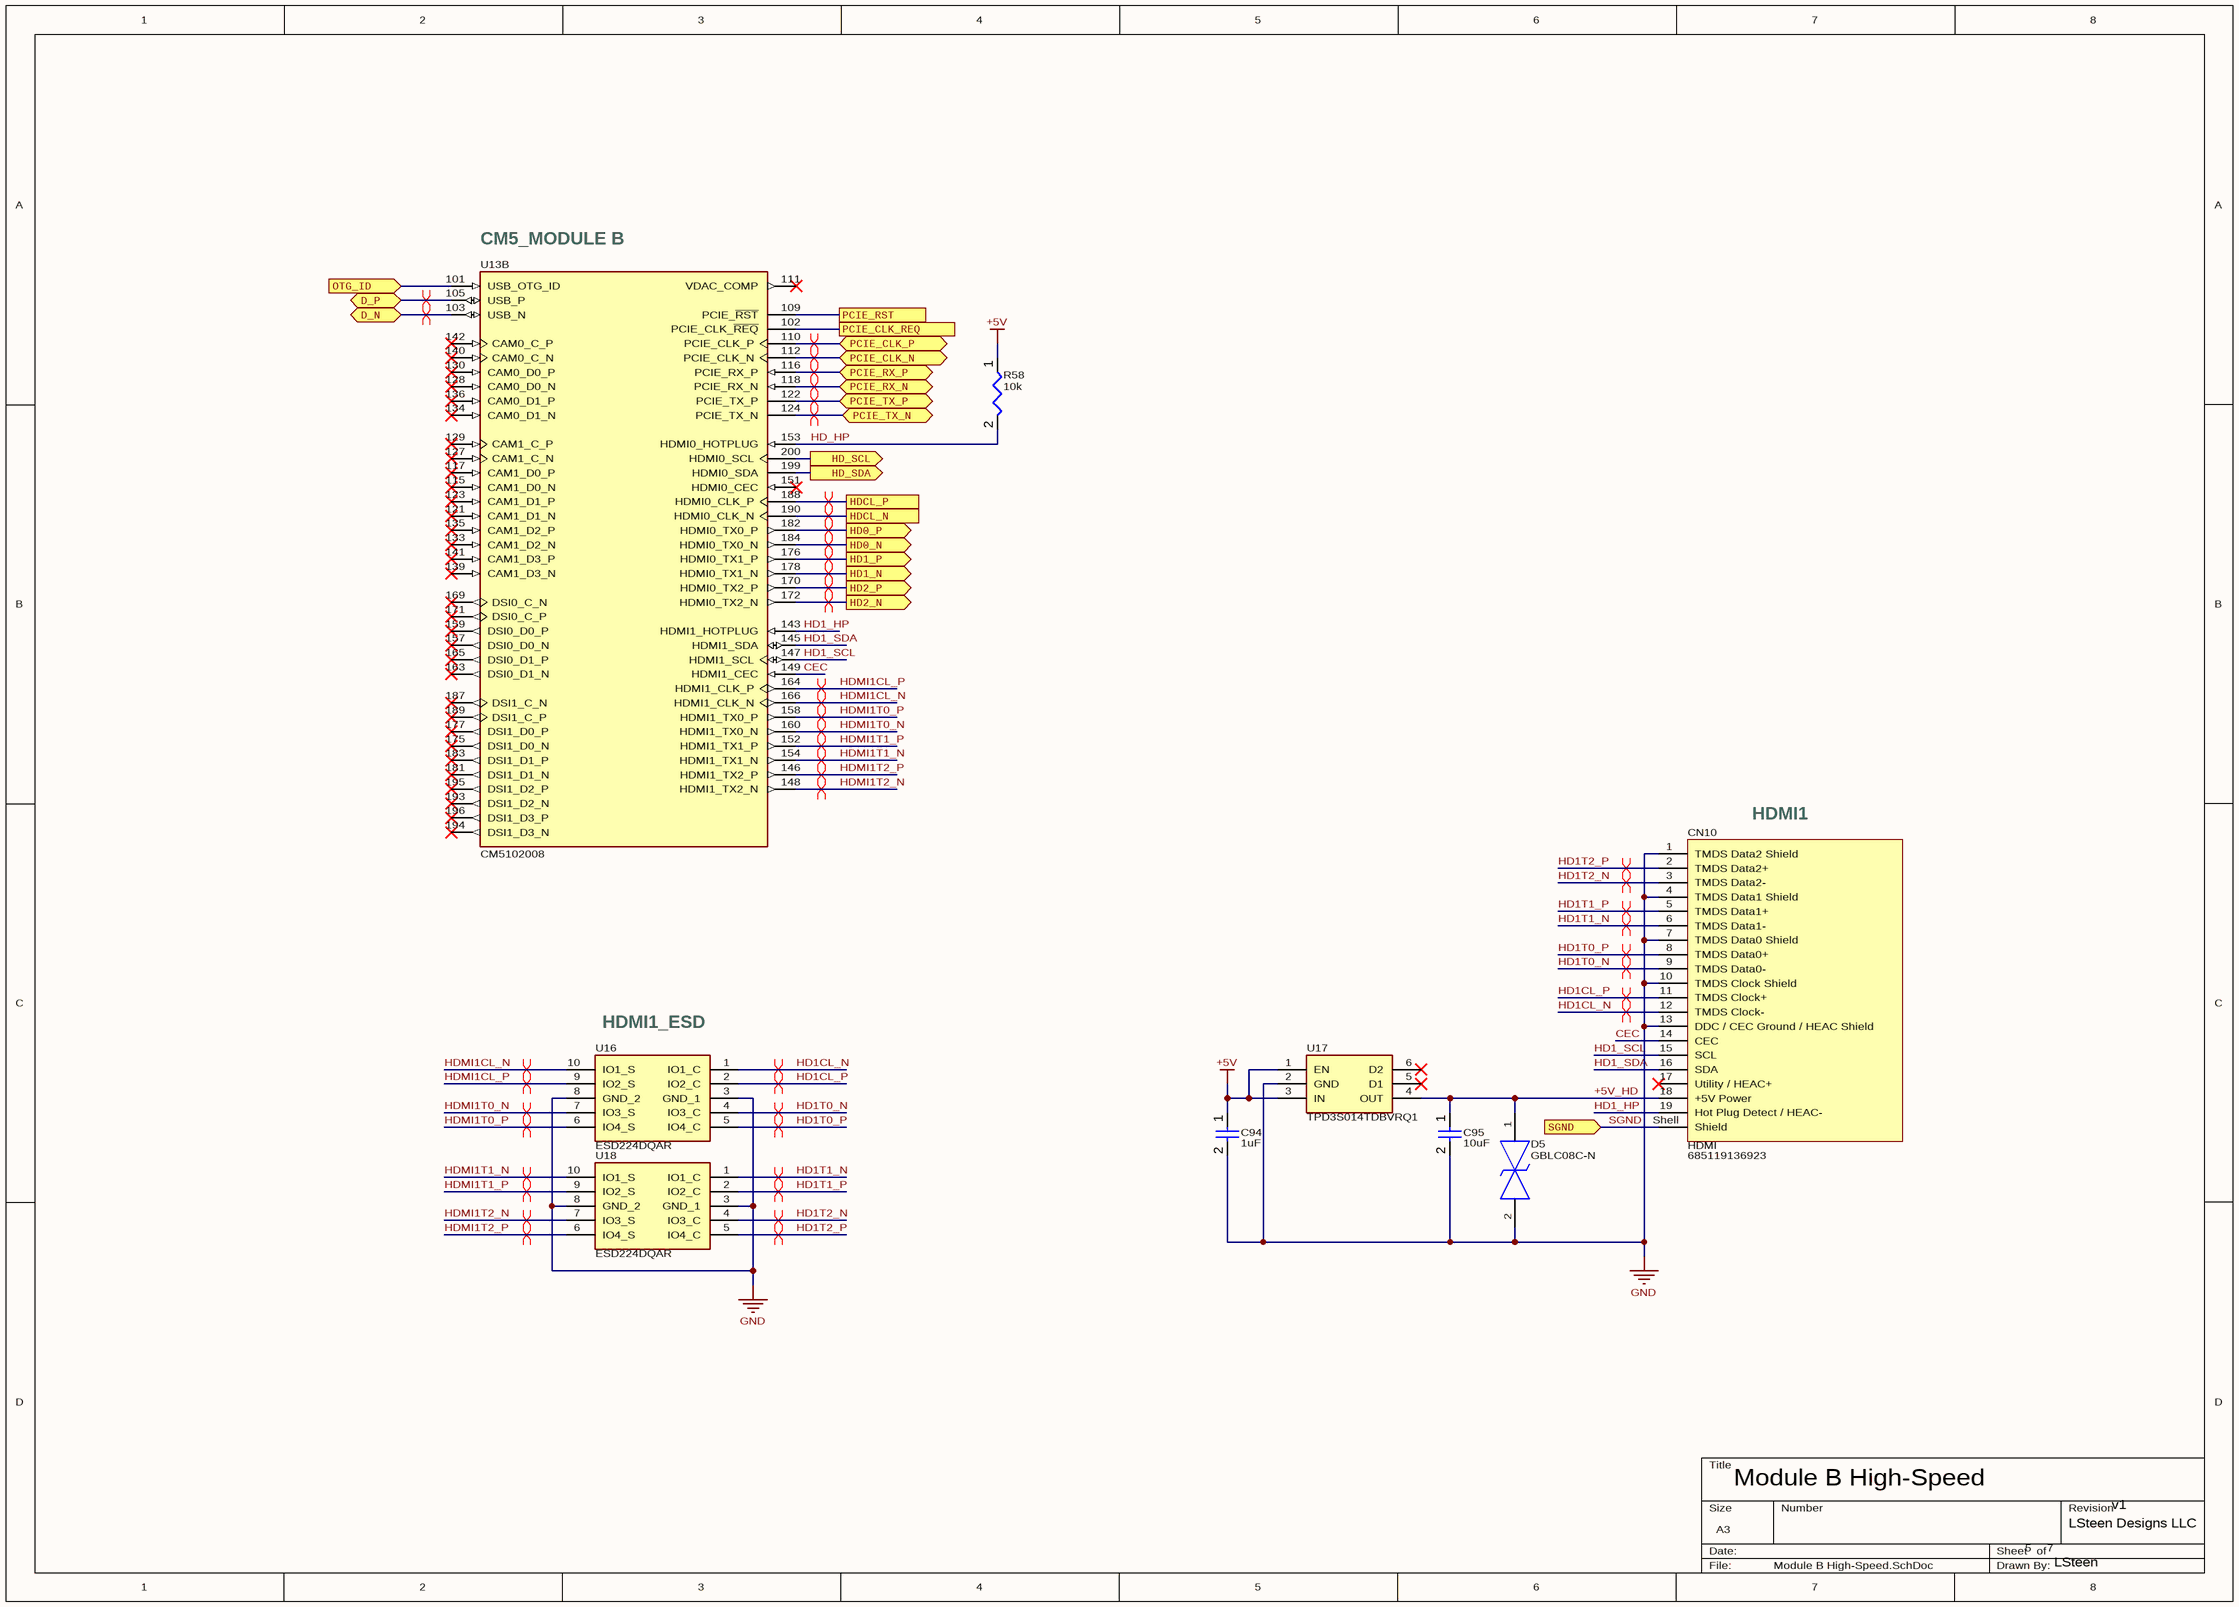
[diagram p5: Module B High-Speed.SchDoc]

### Parts
C94  1uF  [CAPC0603(1608)100_L]
C95  10uF  [CAPC0805(2012)145_L]
CN10  HDMI  [685119136923]
D5  GBLC08C-N  [SOD-323_L1.8-W1.3-LS2.5-BI]
R58  10k  [RESC0402(1005)_L]
U13  CM5102008  [MODULE_CM4102008]  (part B of 2)
U16  ESD224DQAR  [ESD224DQAR]
U17  TPD3S014TDBVRQ1  [SOT95P280X145-6N]
U18  ESD224DQAR  [ESD224DQAR]

### Ports
D_N (bidir, see USB[3C]), D_P (bidir, see USB[3C]), HD0_N (out, see Display[5A]), HD0_P (out, see Display[5A]), HD1_N (out, see Display[6A]), HD1_P (out, see Display[6A]), HD2_N (out, see Display[6A]), HD2_P (out, see Display[6A]), HD_SCL (out, see Display[3B]), HD_SDA (out, see Display[3B]), HDCL_N (see Display[5A]), HDCL_P (see Display[5A]), OTG_ID (in, see USB[2C]), PCIE_CLK_N (bidir, see USB[7B]), PCIE_CLK_P (bidir, see USB[7B]), PCIE_CLK_REQ (see USB[7B]), PCIE_RST (see USB[7B]), PCIE_RX_N (bidir, see USB[7B]), PCIE_RX_P (bidir, see USB[7B]), PCIE_TX_N (bidir, see USB[7B]), PCIE_TX_P (bidir, see USB[7B]), SGND (in, see Power[1A])

### Nets
+5V: C94.1 R58.1 U17.1(EN) U17.3(IN)
GND: C94.2 C95.2 CN10.1(TMDS_Data2_Shield) CN10.4(TMDS_Data1_Shield) CN10.7(TMDS_Data0_Shield) CN10.10(TMDS_Clock_Shield) CN10.13(DDC_/_CEC_Ground_/_HEAC_Shield) D5.2 U16.3(GND_1) U16.8(GND_2) U17.2(GND) U18.3(GND_1) U18.8(GND_2)
+5V_HD: C95.1 CN10.18(+5V_Power) D5.1 U17.4(OUT)
CEC: CN10.14(CEC) U13.149(HDMI1_CEC)
D_N: U13.103(USB_N) ; port D_N
D_P: U13.105(USB_P) ; port D_P
HD0_N: U13.184(HDMI0_TX0_N) ; port HD0_N
HD0_P: U13.182(HDMI0_TX0_P) ; port HD0_P
HD1_HP: CN10.19(Hot_Plug_Detect_/_HEAC-) U13.143(HDMI1_HOTPLUG)
HD1_N: U13.178(HDMI0_TX1_N) ; port HD1_N
HD1_P: U13.176(HDMI0_TX1_P) ; port HD1_P
HD1_SCL: CN10.15(SCL) U13.147(HDMI1_SCL)
HD1_SDA: CN10.16(SDA) U13.145(HDMI1_SDA)
HD1CL_N: CN10.12(TMDS_Clock-) U16.1(IO1_C)
HD1CL_P: CN10.11(TMDS_Clock+) U16.2(IO2_C)
HD1T0_N: CN10.9(TMDS_Data0-) U16.4(IO3_C)
HD1T0_P: CN10.8(TMDS_Data0+) U16.5(IO4_C)
HD1T1_N: CN10.6(TMDS_Data1-) U18.1(IO1_C)
HD1T1_P: CN10.5(TMDS_Data1+) U18.2(IO2_C)
HD1T2_N: CN10.3(TMDS_Data2-) U18.4(IO3_C)
HD1T2_P: CN10.2(TMDS_Data2+) U18.5(IO4_C)
HD2_N: U13.172(HDMI0_TX2_N) ; port HD2_N
HD2_P: U13.170(HDMI0_TX2_P) ; port HD2_P
HD_HP: R58.2 U13.153(HDMI0_HOTPLUG)
HD_SCL: U13.200(HDMI0_SCL) ; port HD_SCL
HD_SDA: U13.199(HDMI0_SDA) ; port HD_SDA
HDCL_N: U13.190(HDMI0_CLK_N) ; port HDCL_N
HDCL_P: U13.188(HDMI0_CLK_P) ; port HDCL_P
HDMI1CL_N: U13.166(HDMI1_CLK_N) U16.10(IO1_S)
HDMI1CL_P: U13.164(HDMI1_CLK_P) U16.9(IO2_S)
HDMI1T0_N: U13.160(HDMI1_TX0_N) U16.7(IO3_S)
HDMI1T0_P: U13.158(HDMI1_TX0_P) U16.6(IO4_S)
HDMI1T1_N: U13.154(HDMI1_TX1_N) U18.10(IO1_S)
HDMI1T1_P: U13.152(HDMI1_TX1_P) U18.9(IO2_S)
HDMI1T2_N: U13.148(HDMI1_TX2_N) U18.7(IO3_S)
HDMI1T2_P: U13.146(HDMI1_TX2_P) U18.6(IO4_S)
OTG_ID: U13.101(USB_OTG_ID) ; port OTG_ID
PCIE_CLK_N: U13.112(PCIE_CLK_N) ; port PCIE_CLK_N
PCIE_CLK_P: U13.110(PCIE_CLK_P) ; port PCIE_CLK_P
PCIE_CLK_REQ: U13.102(PCIE_CLK_~{REQ}) ; port PCIE_CLK_REQ
PCIE_RST: U13.109(PCIE_~{RST}) ; port PCIE_RST
PCIE_RX_N: U13.118(PCIE_RX_N) ; port PCIE_RX_N
PCIE_RX_P: U13.116(PCIE_RX_P) ; port PCIE_RX_P
PCIE_TX_N: U13.124(PCIE_TX_N) ; port PCIE_TX_N
PCIE_TX_P: U13.122(PCIE_TX_P) ; port PCIE_TX_P
SGND: CN10.Shell(Shield) ; port SGND

Not connected (* = marked no-connect by the designer): CN10 17(Utility_/_HEAC+)*; U13 111(VDAC_COMP)* 115(CAM1_D0_N)* 117(CAM1_D0_P)* 121(CAM1_D1_N)* 123(CAM1_D1_P)* 127(CAM1_C_N)* 128(CAM0_D0_N)* 129(CAM1_C_P)* 130(CAM0_D0_P)* 133(CAM1_D2_N)* 134(CAM0_D1_N)* 135(CAM1_D2_P)* 136(CAM0_D1_P)* 139(CAM1_D3_N)* 140(CAM0_C_N)* 141(CAM1_D3_P)* 142(CAM0_C_P)* 151(HDMI0_CEC)* 157(DSI0_D0_N)* 159(DSI0_D0_P)* 163(DSI0_D1_N)* 165(DSI0_D1_P)* 169(DSI0_C_N)* 171(DSI0_C_P)* 175(DSI1_D0_N)* 177(DSI1_D0_P)* 181(DSI1_D1_N)* 183(DSI1_D1_P)* 187(DSI1_C_N)* 189(DSI1_C_P)* 193(DSI1_D2_N)* 194(DSI1_D3_N)* 195(DSI1_D2_P)* 196(DSI1_D3_P)*; U17 5(D1)* 6(D2)*

### Layout directives
differential pair; differential pair class HDMI: HD0_N, HD0_P, HD1_N, HD1_P, HD1CL_N, HD1CL_P, HD1T0_N, HD1T0_P, HD1T1_N, HD1T1_P, HD1T2_N, HD1T2_P, HD2_N, HD2_P, HDCL_N, HDCL_P, HDMI1CL_N, HDMI1CL_P, HDMI1T0_N, HDMI1T0_P, HDMI1T1_N, HDMI1T1_P, HDMI1T2_N, HDMI1T2_P
differential pair; differential pair class USB 2.0: D_N, D_P
differential pair; differential pair class PCIe Gen 3x1: PCIE_CLK_N, PCIE_CLK_P, PCIE_RX_N, PCIE_RX_P, PCIE_TX_N, PCIE_TX_P

### Notes on the sheet
- (near U13) CM5_MODULE B
- HDMI1
- (near U16) HDMI1_ESD
- (near CN10) 685119136923
- Module B High-Speed
- 5
- 7
- LSteen Designs LLC
- v1
- LSteen

### Library data of the parts
C94 = CMP-001-00076-4: as C54 on sheet Power; Mounting Technology: SMT; Case/Package: 0603; Pins: 2; Min Operating Temperature: -55°C; Max Operating Temperature: 85°C; Value: 1uF; Voltage Rating: 10V
C95 = CMP-001-00079-4: as C3 on sheet Power; Max Operating Temperature: 85°C; Value: 10µF; Case/Package: 0805; Voltage Rating: 25V; Min Operating Temperature: -55°C; Mounting Technology: SMT; Pins: 2
CN10 = CMP-1502-00171-2: NexarPartId: 19499823; Number of Contacts: 19; Gender: Receptacle; Operating Supply Voltage: 40V; Contact Resistance: 30mΩ; Body Material: Brass; Current Rating: 500mA; Insulation Resistance: 100MΩ; Lead Free: Lead Free; Max Operating Temperature: 85°C; Packaging: Tape and Reel; Min Operating Temperature: -25°C; Features: Shielded; Orientation: Horizontal; Height: 3.45mm; Number of Positions: 19; Voltage Rating: 40V; Number of Pins: 19; Connector Type: HDMI; Mount: Horizontal, Surface Mount; Contact Material: Gold; Termination: SMD/SMT; Contact Plating: Gold; RoHS: Compliant; REACH SVHC: Unknown
D5 = GBLC08C-N: ESD DIODE-BI_LCSC#C314256
R58 = CMP-009-00138-3: as R48 on sheet Display; Max Operating Temperature: 155°C; Pins: 2; Value: 10k; Min Operating Temperature: -55°C; Case/Package: 0402
U13 = CM4102008: as U13 on sheet Module A IO; SnapEDA_Link: https://www.snapeda.com/parts/CM4102008/Raspberry+Pi/view-part/?ref=snap; Package: None; Value: *; MF: Raspberry Pi; MP: CM4102008; Check_prices: https://www.snapeda.com/parts/CM4102008/Raspberry+Pi/view-part/?ref=eda
U16 U18 = ESD224DQAR: Integrated Circuit; Manufacturer_Name: Texas Instruments; Datasheet Link: http://www.ti.com/lit/gpn/esd224; Height: 0.55mm; Manufacturer_Part_Number: ESD224DQAR; Mouser Part Number: 595-ESD224DQAR; Mouser Price/Stock: https://www.mouser.co.uk/ProductDetail/Texas-Instruments/ESD224DQAR?qs=F5EMLAvA7IDFPTOz5JtaBw%3D%3D; Arrow Part Number: ESD224DQAR; Arrow Price/Stock: https://www.arrow.com/en/products/esd224dqar/texas-instruments?region=nac
U17 = TPD3S014TDBVRQ1: Switch; Manufacturer_Name: Texas Instruments; Datasheet Link: http://www.ti.com/lit/gpn/tpd3s014-q1; Height: 1.45mm; Manufacturer_Part_Number: TPD3S014TDBVRQ1; Mouser Part Number: 595-TPD3S014TDBVRQ1; Mouser Price/Stock: https://www.mouser.co.uk/ProductDetail/Texas-Instruments/TPD3S014TDBVRQ1?qs=f4l5qYp%2Fy%252B4t4RRhQp5Ndw%3D%3D; Arrow Part Number: TPD3S014TDBVRQ1; Arrow Price/Stock: https://www.arrow.com/en/products/tpd3s014tdbvrq1/texas-instruments?region=nac

## Sheet Audio.SchDoc
size A3; SheetNumber: 6; SheetTotal: 7
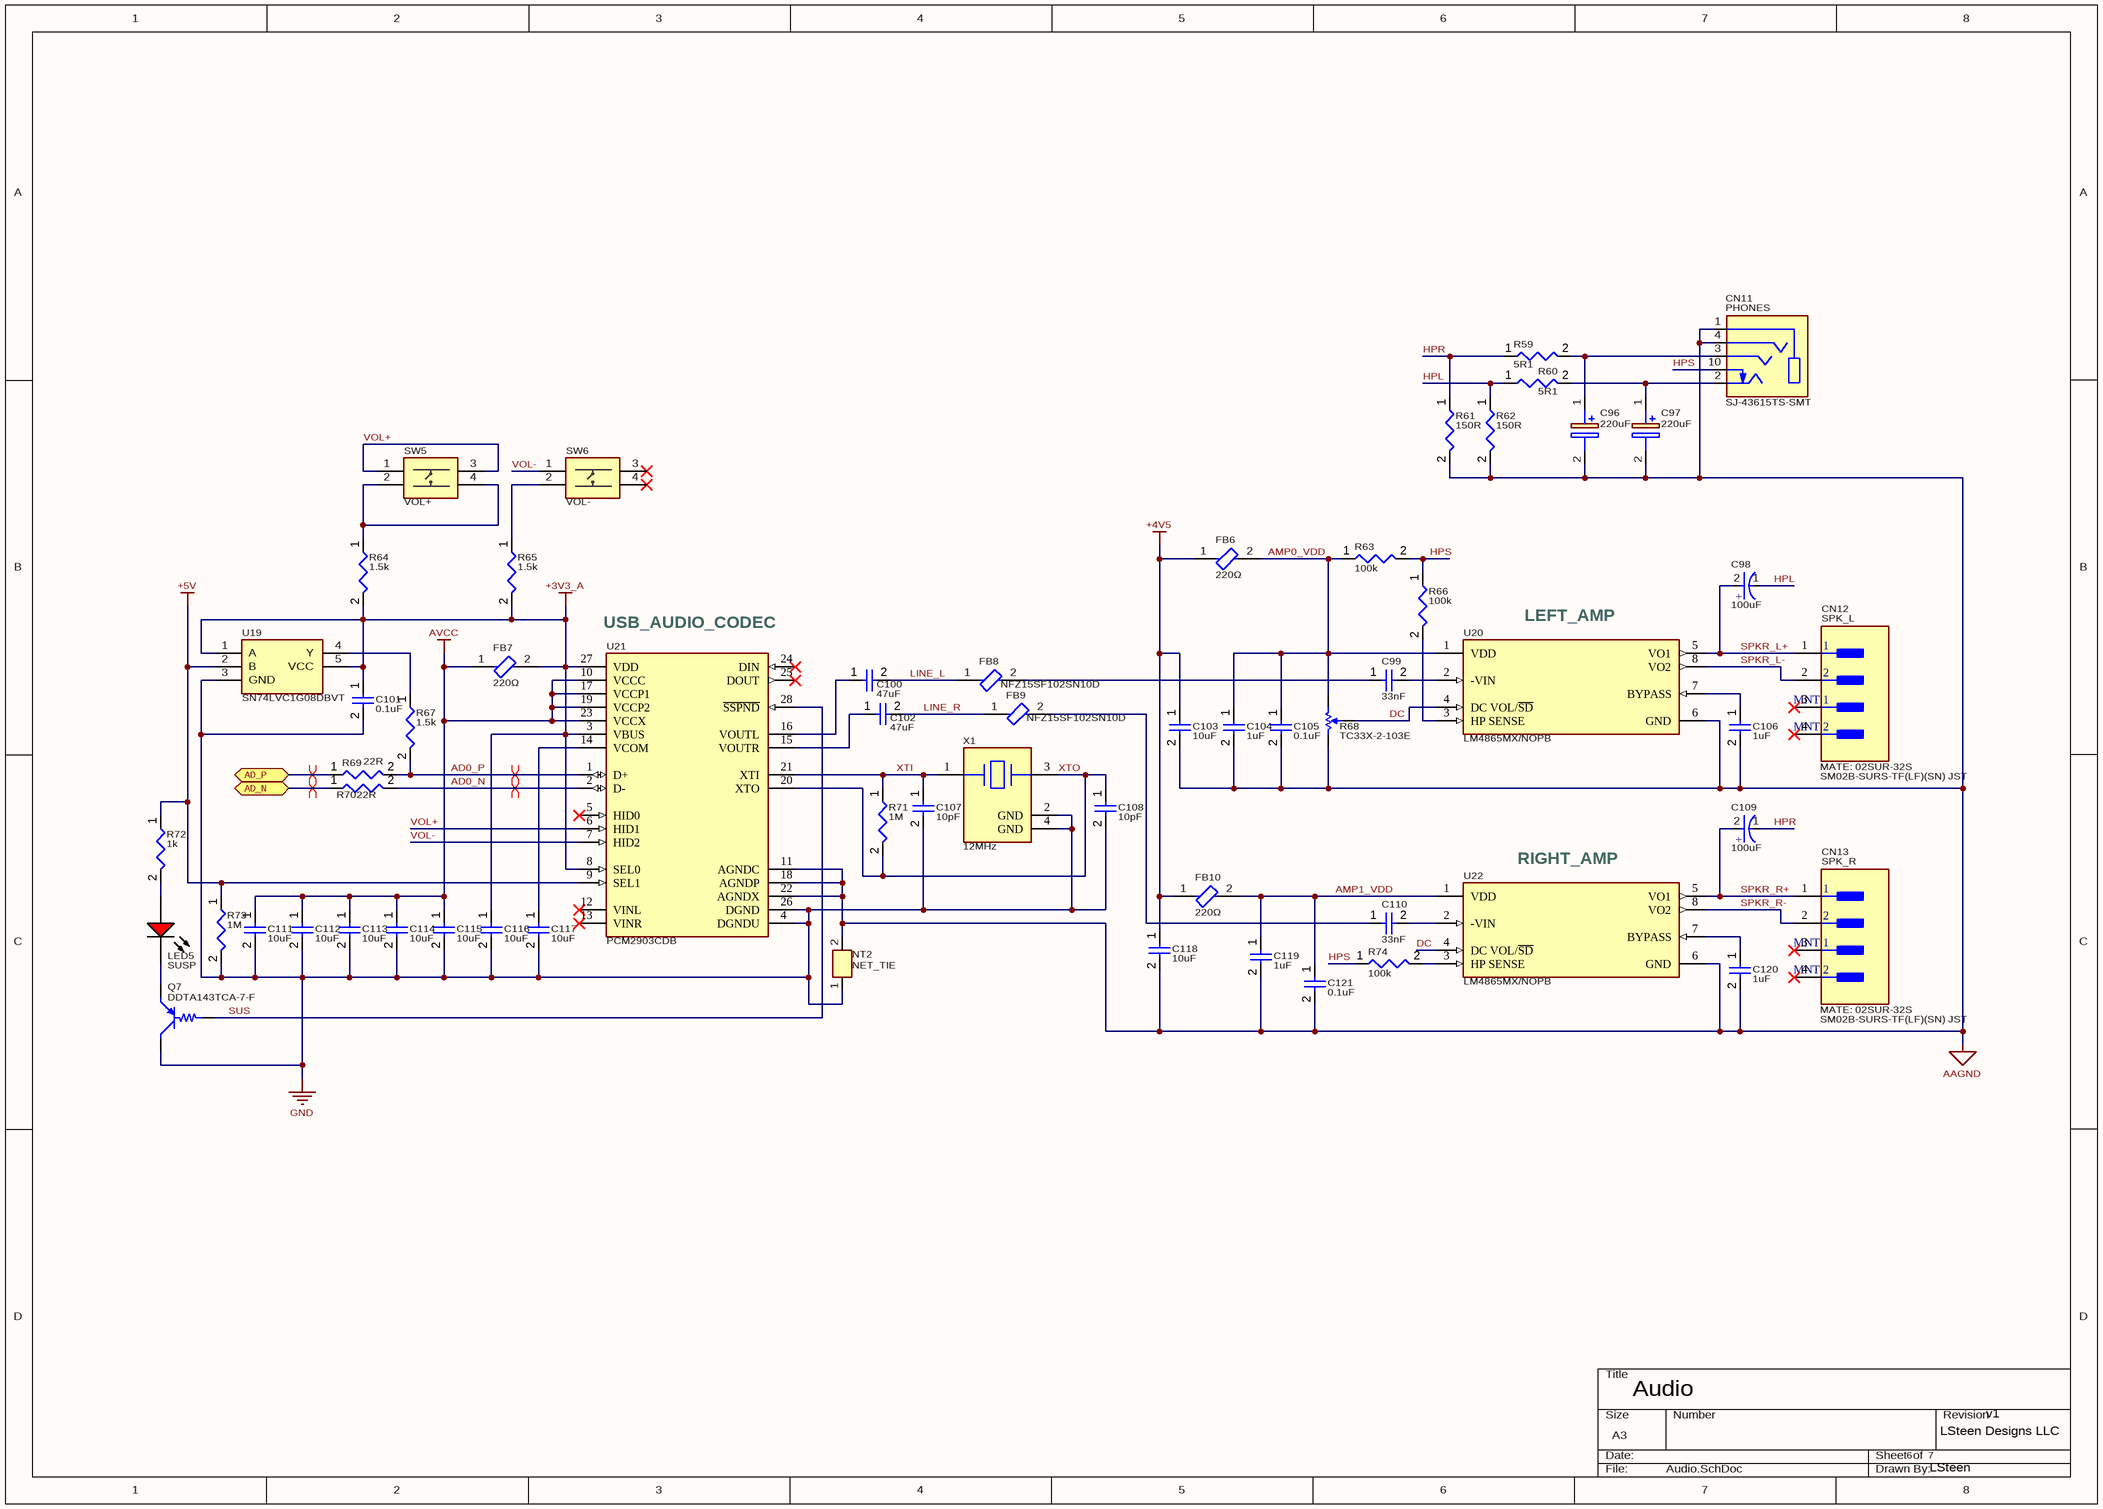
[diagram p6: Audio.SchDoc]

### Parts
C96  220uF  [CAPPM6032X280N]
C97  220uF  [CAPPM6032X280N]
C98  100uF  [FP-CX-MFG]
C99  33nF  [CAPC0603(1608)100_L]
C100  47uF  [CAPC0603(1608)100_L]
C101  0.1uF  [CAPC1005X56X25LL10T15]
C102  47uF  [CAPC0603(1608)100_L]
C103  10uF  [CAPC0805(2012)145_L]
C104  1uF  [CAPC0603(1608)100_L]
C105  0.1uF  [CAPC1005X56X25LL10T15]
C106  1uF  [CAPC0603(1608)100_L]
C107  10pF  [CAPC1005X56X25LL10T15]
C108  10pF  [CAPC1005X56X25LL10T15]
C109  100uF  [FP-CX-MFG]
C110  33nF  [CAPC0603(1608)100_L]
C111  10uF  [CAPC0805(2012)145_L]
C112  10uF  [CAPC1005X56X25LL10T15]
C113  10uF  [CAPC1005X56X25LL10T15]
C114  10uF  [CAPC1005X56X25LL10T15]
C115  10uF  [CAPC1005X56X25LL10T15]
C116  10uF  [CAPC0603(1608)100_L]
C117  10uF  [CAPC1005X56X25LL10T15]
C118  10uF  [CAPC0805(2012)145_L]
C119  1uF  [CAPC0603(1608)100_L]
C120  1uF  [CAPC0603(1608)100_L]
C121  0.1uF  [CAPC1005X56X25LL10T15]
CN11  PHONES  [CUI_SJ-43615TS-SMT]
CN12  SPK_L  [FP-SM02B-SURS-TF_LF_SN-MFG]
CN13  SPK_R  [FP-SM02B-SURS-TF_LF_SN-MFG]
FB6  220Ω  [FP-BLM18-0_15-t0_5-IPC_B]
FB7  220Ω  [FP-BLM18-0_15-t0_5-IPC_B]
FB8  NFZ15SF102SN10D  [FP-NFZ15S-IPC_A]
FB9  NFZ15SF102SN10D  [FP-NFZ15S-IPC_A]
FB10  220Ω  [FP-BLM18-0_15-t0_5-IPC_B]
LED5  SUSP  [EVRL-0603-2_V]
NT2  NET_TIE  [NET_TIE1]  (net tie, no BOM)
Q7  DDTA143TCA-7-F  [SOT96P240X120-3N]
R59  5R1  [RESC2013X50X35ML15T15]
R60  5R1  [RESC2013X50X35ML15T15]
R61  150R  [RESC0402(1005)_L]
R62  150R  [RESC0402(1005)_L]
R63  100k  [RESC0402(1005)_L]
R64  1.5k  [RESC0402(1005)_L]
R65  1.5k  [RESC0402(1005)_L]
R66  100k  [RESC0402(1005)_L]
R67  1.5k  [RESC0402(1005)_L]
R68  TC33X-2-103E  [BOUR-TC33X-2_V]
R69  22R  [RESC0402(1005)_L]
R70  22R  [RESC0402(1005)_L]
R71  1M  [RESC0402(1005)_L]
R72  1k  [RESC0402(1005)_L]
R73  1M  [RESC0402(1005)_L]
R74  100k  [RESC0402(1005)_L]
SW5  VOL+  [APTCLGTVTR]
SW6  VOL-  [APTCLGTVTR]
U19  SN74LVC1G08DBVT  [SOT95P280X145-5N]
U20  LM4865MX/NOPB  [FP-D0008A-IPC_C]
U21  PCM2903CDB  [FP-DB0028A-IPC_A]
U22  LM4865MX/NOPB  [FP-D0008A-IPC_C]
X1  12MHz  [FP-ABM8G-MFG]

### Ports
AD_N (bidir, see USB[1B]), AD_P (bidir, see USB[1B])

### Nets
+3V3_A: C101.1 C116.1 FB7.2 R64.2 R65.2 U19.1(A) U19.5(VCC) U21.3(VBUS) U21.8(SEL0) U21.27(VDD)
+4V5: C103.1 C118.1 FB6.1 FB10.1
+5V: R72.1 R73.1 U19.2(B) U21.9(SEL1)
AAGND: C96.2(-) C97.2(-) C103.2 C104.2 C105.2 C106.2 C118.2 C119.2 C120.2 C121.2 CN11.1(SLEEVE) CN11.4(RING2) NT2.2 R61.2 R62.2 R68.3 U20.6(GND) U21.11(AGNDC) U21.18(AGNDP) U21.22(AGNDX) U22.6(GND)
AVCC: C111.1 C112.1 C113.1 C114.1 C115.1 FB7.1 U21.10(VCCC) U21.17(VCCP1) U21.19(VCCP2) U21.23(VCCX)
GND: C101.2 C107.2 C108.2 C111.2 C112.2 C113.2 C114.2 C115.2 C116.2 C117.2 NT2.1 Q7.3(C) R73.2 U19.3(GND) U21.4(DGNDU) U21.26(DGND) X1.2(GND) X1.4(GND)
AD0_N: R70.2 U21.2(D-)
AD0_P: R67.2 R69.2 U21.1(D+)
AD_N: R70.1 ; port AD_N
AD_P: R69.1 ; port AD_P
AMP0_VDD: C104.1 C105.1 FB6.2 R63.1 R68.1 U20.1(VDD)
AMP1_VDD: C119.1 C121.1 FB10.2 U22.1(VDD)
DC: R68.2 U20.4(DC_VOL/~{SD}) U22.4(DC_VOL/~{SD})
HPL: C98.1(C) R60.1 R62.1
HPR: C109.1(C) R59.1 R61.1
HPS: CN11.10(TIP_SWITCH) R63.2 R66.1 R74.1
LINE_L: C100.2 FB8.1
LINE_R: C102.2 FB9.1
SPKR_L+: C98.2(A) CN12.1 U20.5(VO1)
SPKR_L-: CN12.2 U20.8(VO2)
SPKR_R+: C109.2(A) CN13.1 U22.5(VO1)
SPKR_R-: CN13.2 U22.8(VO2)
SUS: Q7.1(B) U21.28(~{SSPND})
VOL+: SW5.1 SW5.3 U21.6(HID1)
VOL-: SW6.1 U21.7(HID2)
XTI: C107.1 R71.1 U21.21(XTI) X1.1
XTO: C108.1 R71.2 U21.20(XTO) X1.3
NetC96_1: C96.1(+) CN11.3(RING1) R59.2
NetC97_1: C97.1(+) CN11.2(TIP) R60.2
NetC99_1: C99.1 FB8.2
NetC99_2: C99.2 U20.2(-VIN)
NetC100_1: C100.1 U21.16(VOUTL)
NetC102_1: C102.1 U21.15(VOUTR)
NetC106_1: C106.1 U20.7(BYPASS)
NetC110_1: C110.1 FB9.2
NetC110_2: C110.2 U22.2(-VIN)
NetC117_1: C117.1 U21.14(VCOM)
NetC120_1: C120.1 U22.7(BYPASS)
NetLED5_1: LED5.1(A) R72.2
NetLED5_2: LED5.2(K) Q7.2(E)
NetR64_1: R64.1 SW5.2 SW5.4
NetR65_1: R65.1 SW6.2
NetR66_2: R66.2 U20.3(HP_SENSE)
NetR67_1: R67.1 U19.4(Y)
NetR74_2: R74.2 U22.3(HP_SENSE)

Not connected (* = marked no-connect by the designer): CN12 3(MNT_1)* 4(MNT_2)*; CN13 3(MNT_1)* 4(MNT_2)*; SW6 3* 4*; U21 5(HID0)* 12(VINL)* 13(VINR)* 24(DIN)* 25(DOUT)*

### Layout directives
differential pair: AD_N, AD_P
differential pair; differential pair class USB 2.0: AD0_N, AD0_P

### Notes on the sheet
- (near CN11) SJ-43615TS-SMT
- (near U21) USB_AUDIO_CODEC
- (near U20) LEFT_AMP
- (near CN12) MATE: 02SUR-32S
- (near CN12) SM02B-SURS-TF(LF)(SN) JST
- (near U22) RIGHT_AMP
- (near CN13) MATE: 02SUR-32S
- (near CN13) SM02B-SURS-TF(LF)(SN) JST
- Audio
- 6
- 7
- LSteen Designs LLC
- v1
- LSteen
- (in symbol CMP-05427-000056-1) +

### Library data of the parts
C96 C97 = TR3C227K6R3C0225: Capacitor Polarised; Manufacturer_Name: Vishay; Datasheet Link: http://www.vishay.com/doc?40080; Height: 2.8mm; Manufacturer_Part_Number: TR3C227K6R3C0225; Supplier 1: Mouser; Supplier Part Number 1: 74-TR3C227K6R3C0225
C98 C109 = CMP-05427-000056-1: CAP ALUM POLY 100UF 20% 6.3V SMD; Leakage Current: 63uA; Polarity: Polar; Lead Diameter: 2.4mm; Dissipation Factor: 0.06%; Ripple Current: 2.7A; ESR (Equivalent Series Resistance): 15mR; Life (Hours): 1000Hour; Voltage Rating: 6.3V; Case/Package: 2917; Lead Pitch: 1.3mm; Series: SP-Cap CX; Weight: 0.004586oz; Radiation Hardening: No; Case Code (Imperial): 2917; Length: 7.3mm; Number of Pins: 2; Lead Free: Lead Free; REACH SVHC: No SVHC; Max Operating Temperature: 105°C; Package Quantity: 3500; Packaging: Tape and Reel; Height - Seated (Max): 0.075inch; Mount: Surface Mount; Height: 1.9mm; Termination: SMD/SMT; Voltage: 6.3V; Construction: Flat; Width: 0.169inch; Ripple Current (AC): 2.7A; Capacitance: 100uF; Voltage Rating (DC): 6.3V; Case Code (Metric): 7343; Min Operating Temperature: -40°C; Tolerance: 20%; RoHS Compliant: Yes; Depth: 4.3mm
C99 C110 = CMP-001-00076-4: Chip Capacitor, 33nF +/-20%, 10V, 0603, Thickness 1 mm; Tolerance: 10%; Mounting Technology: SMT; Case/Package: 0603; Pins: 2; Min Operating Temperature: -55°C; Max Operating Temperature: 85°C; Value: 33nF; Voltage Rating: 10V
C100 C102 = CMP-001-00076-4: Chip Capacitor, 47uF +/-20%, 10V, 0603, Thickness 1 mm; Tolerance: 10%; Mounting Technology: SMT; Case/Package: 0603; Pins: 2; Min Operating Temperature: -55°C; Max Operating Temperature: 85°C; Value: 47uF; Voltage Rating: 10V
C101 C105 C121 = CMP-001-00001-6: Chip Capacitor, 0.1 uF, +/- 5%, 16 V, 0402 (1005 Metric); Capacitor Type: Ceramic; Voltage Rating: 16V; Max Operating Temperature: 125°C; Min Operating Temperature: -55°C; Case/Package: 0402; Value: 0.1uF; Mounting Technology: SM; Pins: 2; Tolerance: 5%; RoHS Compliant: True
C103 C111 C118 = CMP-001-00079-4: Chip Capacitor, 10µF +/-20%, 25V, 0805, Thickness 1.45 mm; Tolerance: 10%; Max Operating Temperature: 85°C; Value: 10µF; Case/Package: 0805; Voltage Rating: 25V; Min Operating Temperature: -55°C; Mounting Technology: SMT; Pins: 2
C104 C106 C119 C120 = CMP-001-00076-4: Chip Capacitor, 1uF +/-20%, 10V, 0603, Thickness 1 mm; Tolerance: 10%; Mounting Technology: SMT; Case/Package: 0603; Pins: 2; Min Operating Temperature: -55°C; Max Operating Temperature: 85°C; Value: 1uF; Voltage Rating: 10V
C107 C108 = CMP-001-00001-6: Chip Capacitor, 10 pF, +/- 5%, 16 V, 0402 (1005 Metric); Capacitor Type: Ceramic; Voltage Rating: 16V; Max Operating Temperature: 125°C; Min Operating Temperature: -55°C; Case/Package: 0402; Value: 10pF; Mounting Technology: SM; Pins: 2; Tolerance: 5%; RoHS Compliant: True
C112-C115 C117 = CMP-001-00001-6: Chip Capacitor, 10 uF, +/- 5%, 16 V, 0402 (1005 Metric); Capacitor Type: Ceramic; Voltage Rating: 16V; Max Operating Temperature: 125°C; Min Operating Temperature: -55°C; Case/Package: 0402; Value: 10uF; Mounting Technology: SM; Pins: 2; Tolerance: 5%; RoHS Compliant: True
C116 = CMP-001-00076-4: Chip Capacitor, 10uF +/-20%, 10V, 0603, Thickness 1 mm; Tolerance: 10%; Mounting Technology: SMT; Case/Package: 0603; Pins: 2; Min Operating Temperature: -55°C; Max Operating Temperature: 85°C; Value: 10uF; Voltage Rating: 10V
CN11 = SJ-43615TS-SMT: 4 Conductor 3.5 mm Mid Mount SMT Audio Jack w/ Tip Switch; MP: SJ-43615TS-SMT; Value: *; Package: None; Price: None; Availability: Unavailable; Supplier 1: Mouser; Supplier Part Number 1: 490-SJ43615TSSMTTR
CN12 = CMP-17439-000279-1: LCSC_CONN HEADER SMD R/A 2POS 0.8MM; Manufacturer Part Number: SM02B-SURS-TF(LF)(SN); Number of Contacts: 2; Working Voltage: 30V; Wire/Cable Gauge: 32AWG; Gender: Male; Body Plating: Tin; Current Rating: 500mA; Lead Pitch: 0.8mm; Color: Natural; Min Operating Temperature: -25°C; Insulation Material: Nylon; Number of Rows: 1; Flammability Rating: UL94 V-0; Number of Positions: 2; Contact Shape: Rectangular; Orientation: Horizontal; Contact Material: Copper Alloy; Fastening Type: Pull; Max Operating Temperature: 85°C; Termination: Solder; Contact Type: Outer Shroud Contact; Series: SUR; Insulation Color: Natural; Packaging: Cut Tape; Contact Finish - Mating: TIN; REACH SVHC: No SVHC; Pitch: 0.8mm; Contact Plating: Tin; Lead Free: Lead Free; Voltage Rating: 30V; Mount: Surface Mount; Connector Type: Header; Number of Poles: 2; Material: Polyamide
CN13 = CMP-17439-000279-1: LCSC_CONN HEADER SMD R/A 2POS 0.8MM; Number of Contacts: 2; Working Voltage: 30V; Wire/Cable Gauge: 32AWG; Gender: Male; Body Plating: Tin; Current Rating: 500mA; Lead Pitch: 0.8mm; Color: Natural; Min Operating Temperature: -25°C; Insulation Material: Nylon; Number of Rows: 1; Flammability Rating: UL94 V-0; Number of Positions: 2; Contact Shape: Rectangular; Orientation: Horizontal; Contact Material: Copper Alloy; Fastening Type: Pull; Max Operating Temperature: 85°C; Termination: Solder; Contact Type: Outer Shroud Contact; Series: SUR; Insulation Color: Natural; Packaging: Cut Tape; Contact Finish - Mating: TIN; REACH SVHC: No SVHC; Pitch: 0.8mm; Contact Plating: Tin; Lead Free: Lead Free; Voltage Rating: 30V; Mount: Surface Mount; Connector Type: Header; Number of Poles: 2; Material: Polyamide
FB6 FB7 FB10 = CMP-06046-002311-1: Chip Ferrite Bead, 0603, 220Ω @ 100MHz, 25%, 0.04Ω, 2.5A; RoHS Compliant: Yes
FB8 FB9 = CMP-06046-002280-1: Ferrite Bead 1000Ω @ 100MHz ±25% 230mA 1.4Ω 0402 Paper T/R
LED5 = CMP-2100-03578-1: Chip LED, Red, 5 V, 25 mA, -40 to 85 degC, 2-Pin SMD (0603), RoHS, Tape and Reel; Manufacturer: Everlight Electronics; Manufacturer Part Number: 19-217/R6C-AL1M2VY/3T; Forward Voltage: 2.2V; Lens Style: Clear; Shape: Rectangular; Forward Current: 25mA; Luminous Intensity-Nom: 20mcd; Channels: 1; Optoelectronic Device Type: SINGLE COLOR LED; Viewing Angle: 120°; Overall Height: 0.4mm; Package Reference: 0603; Case/Package: 0603; RoHSCompliant: false; Package Description: 2-Pin Surface Mount Device, Body 1.6 x 0.8 mm; Colour: Red; Lead Free: LeadFree; Datasheet URL: https://datasheet.ciiva.com/4688/el-19-217-r6c-al1m2vy-3tpdf-187026-4688713.pdf; Manufacturer URL: http://www.everlight.com/; Datasheet Version: Rev. 1, 01/2005; Supplier: Digikey; Supplier Part Number: 1080-1585-6-ND; RoHS: Yes; Category: LEDs; Mounting Technology: Surface Mount; Pins: 2; Color: Red; Min Operating Temperature: -40°C; Max Operating Temperature: 85°C; Packaging: Tape and Reel; Size: 1mm; Terminal Pitch: 1.5mm; Reach SVHC Compliant: Yes; RoHS Compliant: Yes; ComponentLink1URL: https://datasheet.ciiva.com:443/pdfs/VipMasterIC/IC/EVER/EVER-S-A0007433843/EVER-S-A0007433843-1.pdf?src-supplier=IHS+Markit; ComponentLink1Description: https://datasheet.ciiva.com:443/pdfs/VipMasterIC/IC/EVER/EVER-S-A0007433843/EVER-S-A0007433843-1.pdf?src-supplier=IHS+Markit; ComponentLink2URL: https://media.digikey.com/pdf/Data%20Sheets/Everlight%20PDFs/19-217-R6C-AL1M2VY-3T.pdf?src-supplier=Digikey; ComponentLink2Description: https://media.digikey.com/pdf/Data%20Sheets/Everlight%20PDFs/19-217-R6C-AL1M2VY-3T.pdf?src-supplier=Digikey
Q7 = DDTA143TCA-7-F: PNP TRANSISTOR; Supplier 1: Mouser; Supplier Part Number 1: 621-DDTA143TCA-F
R59 R60 = CMP-009-00018-5: Chip Resistor, 5.1 Ohm, +/- 1%, 125 mW, -55 to 155 degC, 0805 (2012 Metric); Power: 125mW; Voltage Rating: 150V; Tolerance: 1%; Pins: 2; Min Operating Temperature: -55°C; Case/Package: 0805; Max Operating Temperature: 155°C; RoHS Compliant: True; Value: 5R1; Mounting Technology: SM
R61 R62 = CMP-009-00138-3: Chip Resistor, 150 Ohms, +/-5 %, 63 mW, -55 to 155 degC, 0402; Tolerance: 5%; Power: 63mW; Max Operating Temperature: 155°C; Pins: 2; Value: 150R; Min Operating Temperature: -55°C; Case/Package: 0402
R63 R66 R74 = CMP-009-00138-3: Chip Resistor, 100 kOhms, +/-5 %, 63 mW, -55 to 155 degC, 0402; Tolerance: 5%; Power: 63mW; Max Operating Temperature: 155°C; Pins: 2; Value: 100k; Min Operating Temperature: -55°C; Case/Package: 0402
R64 R65 R67 = CMP-009-00138-3: Chip Resistor, 1.5 kOhms, +/-5 %, 63 mW, -55 to 155 degC, 0402; Tolerance: 5%; Power: 63mW; Max Operating Temperature: 155°C; Pins: 2; Value: 1.5k; Min Operating Temperature: -55°C; Case/Package: 0402
R68 = CMP-2100-03695-1: Trimming Potentiometer, 10000 Ohm, -40 to 100 degC, 3-Pin SMD, RoHS, Tape and Reel; Manufacturer: Bourns; Tolerance: 25%; Max Power Dissipation: 100mW; Number of Turns: 1; Resistance: 10KOhm; Temperature Coefficient: 250ppm/degreesC; Voltage Rating (DC): 50V; Datasheet URL: http://www.bourns.com/docs/Product-Datasheets/TC33.pdf; Composition: Potentiometer; Package Description: 3-Pin Surface Mount Device, Body 3.8 x 3.6 mm; Weight: 29.4mg; Power Rating: 100mW; Termination: FootPrint; Manufacturer URL: http://www.bourns.com/; Width: 0.118inch; Height: 0.047inch; Military Standard: Not; Radiation Hardening: No; Colour: Silver; Case/Package: SMD/SMT; Depth: 3.8mm; Min Operating Temperature: -40degC; Lead Free: LeadFree; Datasheet Version: 42583.0; REACH SVHC: NoSVHC; Length: 3mm; RoHSCompliant: true; Contact Plating: Silver; Taper: Linear; Packaging: TapeandReel; Mount: SurfaceMount; Max Operating Temperature: 100degC; Package Reference: TC33X-2; Package Quantity: 2500
R69 R70 = CMP-009-00138-3: Chip Resistor, 22 Ohms, +/-5 %, 63 mW, -55 to 155 degC, 0402; Tolerance: 5%; Power: 63mW; Max Operating Temperature: 155°C; Pins: 2; Value: 22R; Min Operating Temperature: -55°C; Case/Package: 0402
R71 R73 = CMP-009-00138-3: Chip Resistor, 1 MOhms, +/-5 %, 63 mW, -55 to 155 degC, 0402; Tolerance: 5%; Power: 63mW; Max Operating Temperature: 155°C; Pins: 2; Value: 1M; Min Operating Temperature: -55°C; Case/Package: 0402
R72 = CMP-009-00138-3: Chip Resistor, 1 kOhms, +/-5 %, 63 mW, -55 to 155 degC, 0402; Tolerance: 5%; Power: 63mW; Max Operating Temperature: 155°C; Pins: 2; Value: 1k; Min Operating Temperature: -55°C; Case/Package: 0402
SW5 SW6 = APTCLGTVTR: Switch; Manufacturer_Name: Apem; Datasheet Link: https://media.digikey.com/pdf/Data%20Sheets/APEM%20Components%20PDFs/APTCLGTV.pdf; Height: 1.87mm; Manufacturer_Part_Number: APTCLGTVTR; Mouser Part Number: 642-APTCLGTVTR; Mouser Price/Stock: https://www.mouser.co.uk/ProductDetail/Apem/APTCLGTVTR?qs=ikKlZSMjbcRNf%252Bwzp31ctg%3D%3D; Supplier 1: Mouser; Supplier Part Number 1: 642-APTCLGTVTR
U19 = SN74LVC1G08DBVT: Integrated Circuit; Manufacturer_Name: Texas Instruments; Datasheet Link: http://www.ti.com/lit/gpn/sn74lvc1g08; Height: 1.45mm; Manufacturer_Part_Number: SN74LVC1G08DBVT; Mouser Part Number: 595-SN74LVC1G08DBVT; Mouser Price/Stock: https://www.mouser.co.uk/ProductDetail/Texas-Instruments/SN74LVC1G08DBVT?qs=nqigI8dpoHJVJyaZlPLFSg%3D%3D; Arrow Part Number: SN74LVC1G08DBVT; Arrow Price/Stock: https://www.arrow.com/en/products/sn74lvc1g08dbvt/texas-instruments?region=nac
U20 U22 = CMP-04894-000019-1: IC AMP CLASS AB MONO 1W 8SOIC; Quiescent Current: 3.5mA; Min Supply Voltage: 2.7V; Max Supply Voltage: 5.5V; Power Supply Rejection Ratio (PSRR): 50dB; Supply Type: Single; Operating Supply Voltage: 5V; Supply Current: 4mA; Number of Channels: 1; Gain: 20dB; Contact Plating: Tin; Series: Boomer®; Min Operating Temperature: -40°C; Max Output Power: 1W; Packaging: Tape and Reel; RoHS Compliant: Yes; Case/Package: SOIC N; Lead Free: Lead Free; Max Operating Temperature: 85°C; Radiation Hardening: No; Mount: Surface Mount; Number of Pins: 8; Output Power: 1W; Package Quantity: 1; Nominal Supply Current: 4mA
U21 = CMP-04873-000010-1: IC STERO AUD CODEC W/USB 28SSOP; Supply Current: 70mA; Max Supply Voltage: 3.6V; Number of DAC Channels: 2; Min Supply Voltage: 3V; Operating Supply Voltage: 3.3V; Resolution: 16b; Interface: USB; Sampling Rate: 48KS/s; Signal to Noise Ratio (SNR): 89dB; Nominal Supply Current: 70mA; Series: -; Radiation Hardening: No; Number of ADC Channels: 2; Package Quantity: 50; RoHS Compliant: Yes; Number of D/A Converters: 2; Number of A/D Converters: 2; Packaging: Rail/Tube; Number of Analog Outputs: 2; Mount: Surface Mount; Max Operating Temperature: 85°C; REACH SVHC: No SVHC; Min Operating Temperature: -25°C; Lead Free: Lead Free; Number of Analog Inputs: 2; Number of Pins: 28; Case/Package: SSOP
X1 = CMP-27762-015546-1: Crystal 12MHz ±30ppm (Tol) ±30ppm (Stability) 10pF FUND 120Ω 4-Pin SMD T/R; ESR (Equivalent Series Resistance): 120R; Height: 1mm; Operating Frequency: 12 MHz; Case/Package: CSMD; Max Operating Temperature: 70°C; Load Capacitance: 10pF; Series: ABM8G; Depth: 2.5mm; Package Quantity: 1000; Frequency: 12MHz; Min Operating Temperature: -20°C; Length: 3.2mm; Termination: SMD/SMT; Frequency Tolerance: 30ppm; Frequency Stability: 30ppm; Tolerance: 30ppm; Lead Free: Lead Free; Number of Pins: 4; Mount: Surface Mount; Width: 2.5mm; Packaging: Tape and Reel